# EAGLE design dio-pci (EAGLE 6.5.0)
DESIGNER: OPEN EPHYS; DESIGN_NAME: FMC ACQUISITION ADAPTER; REVISION: 0.1
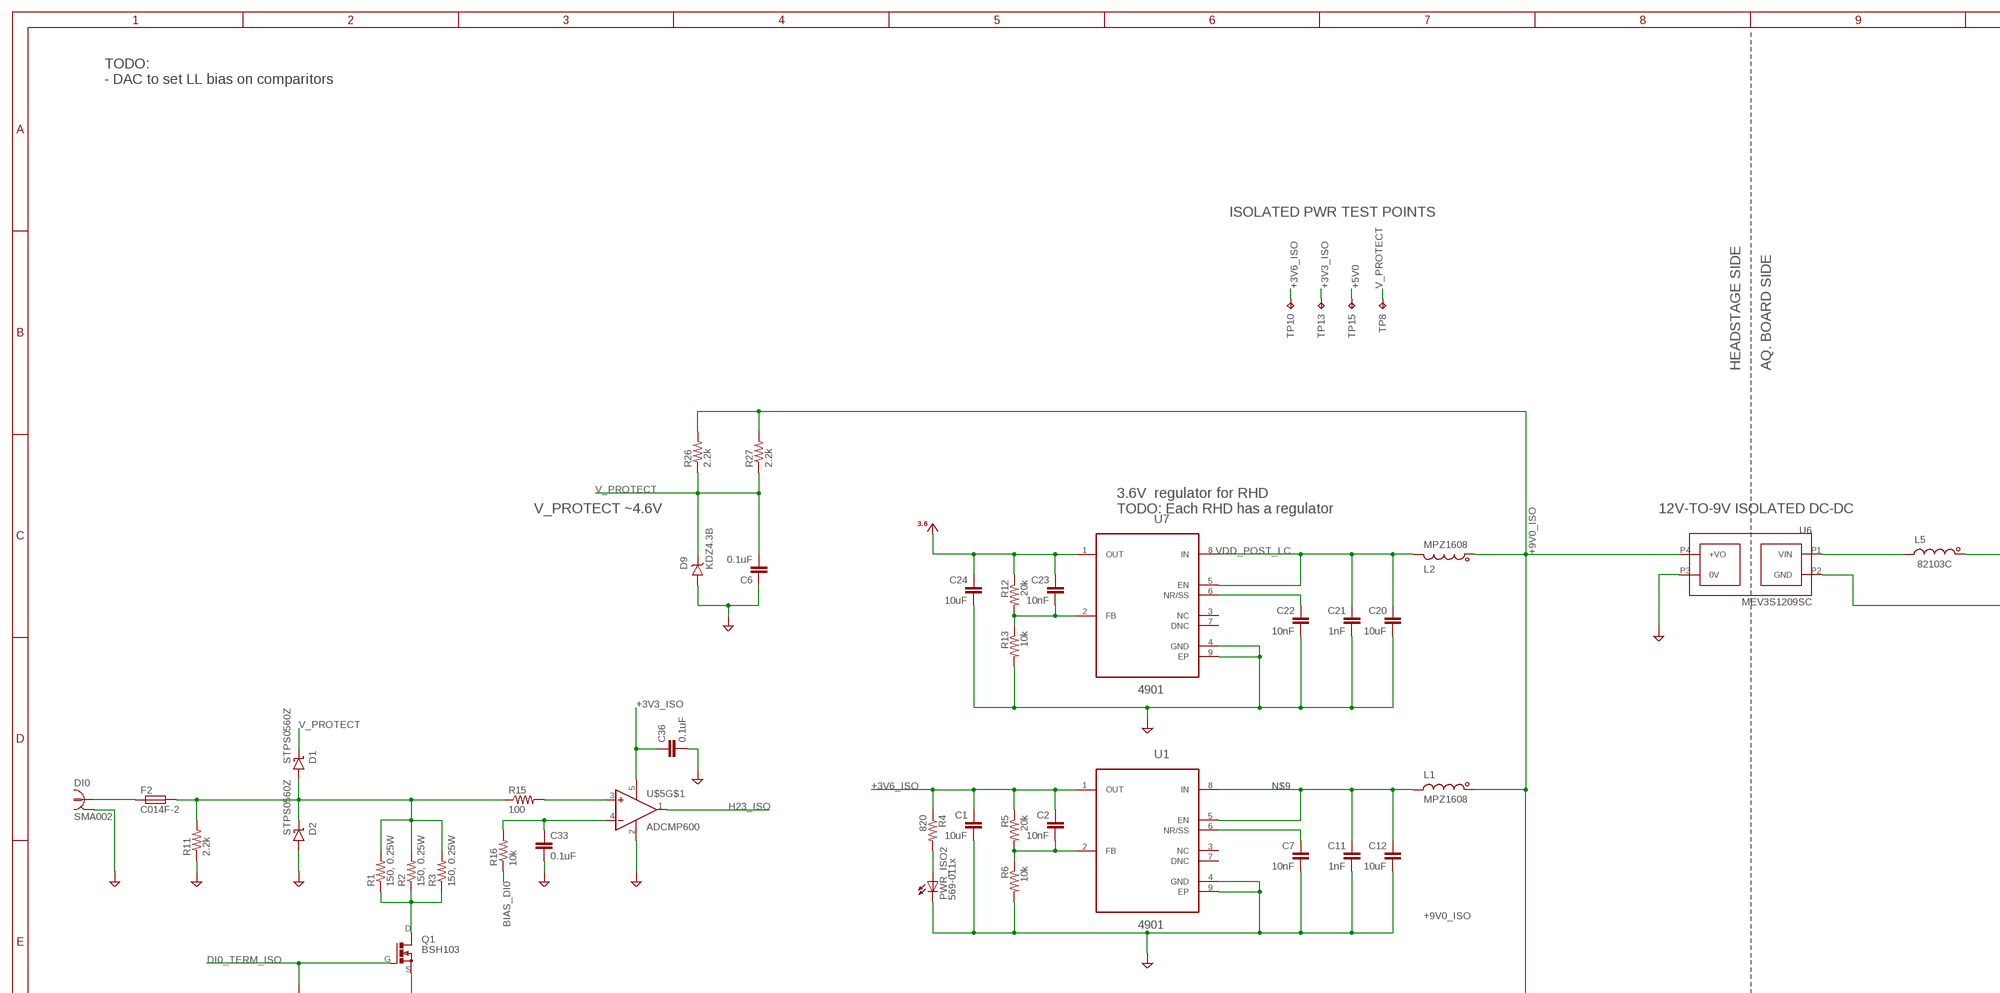
[diagram p0: schematic, sheet 1, part 1 of 3]
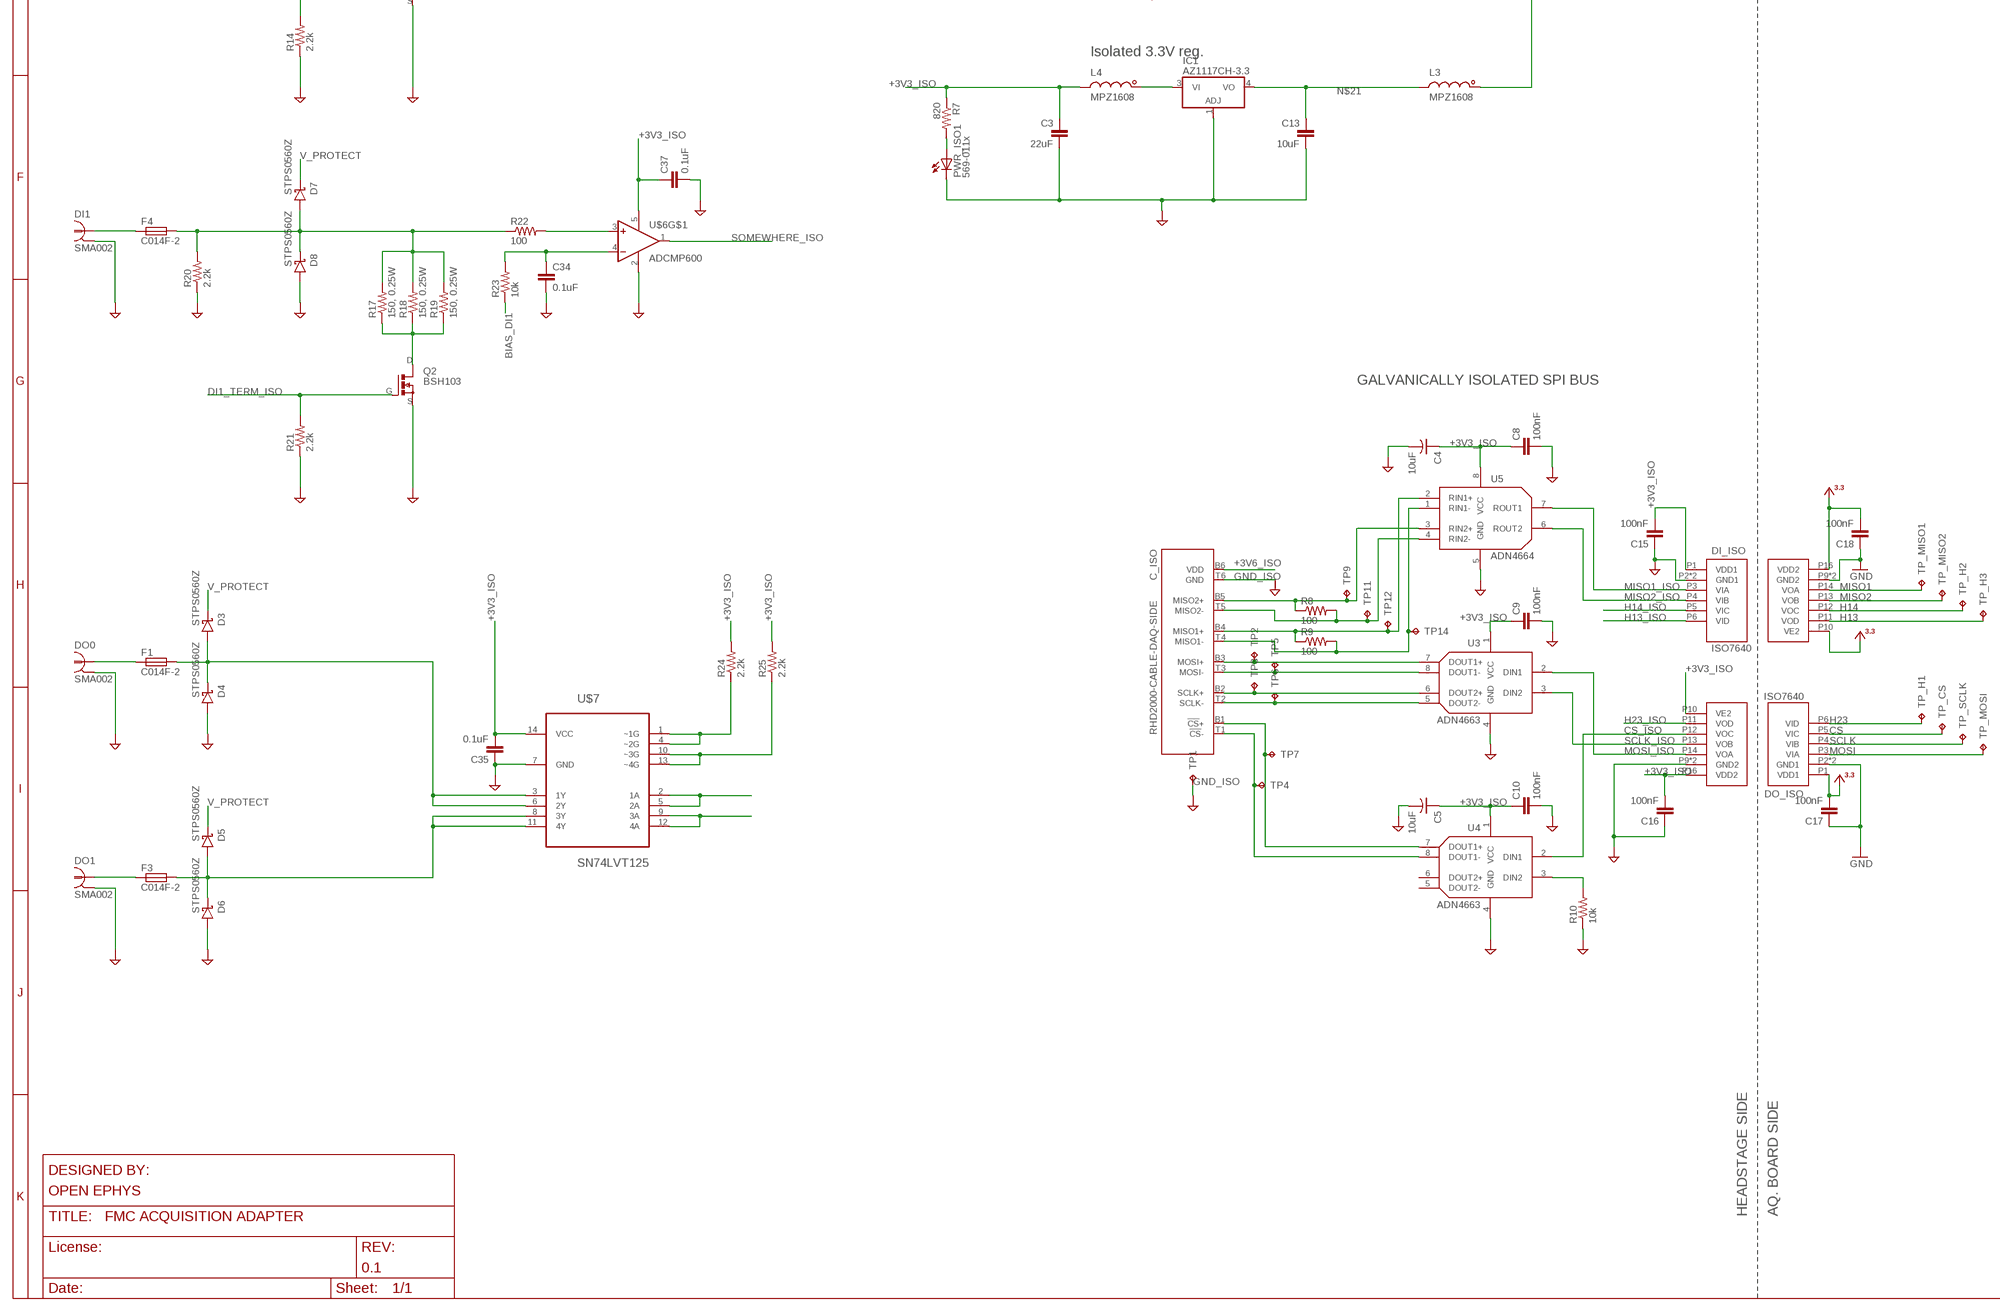
[diagram p1: schematic, sheet 1, part 2 of 3]
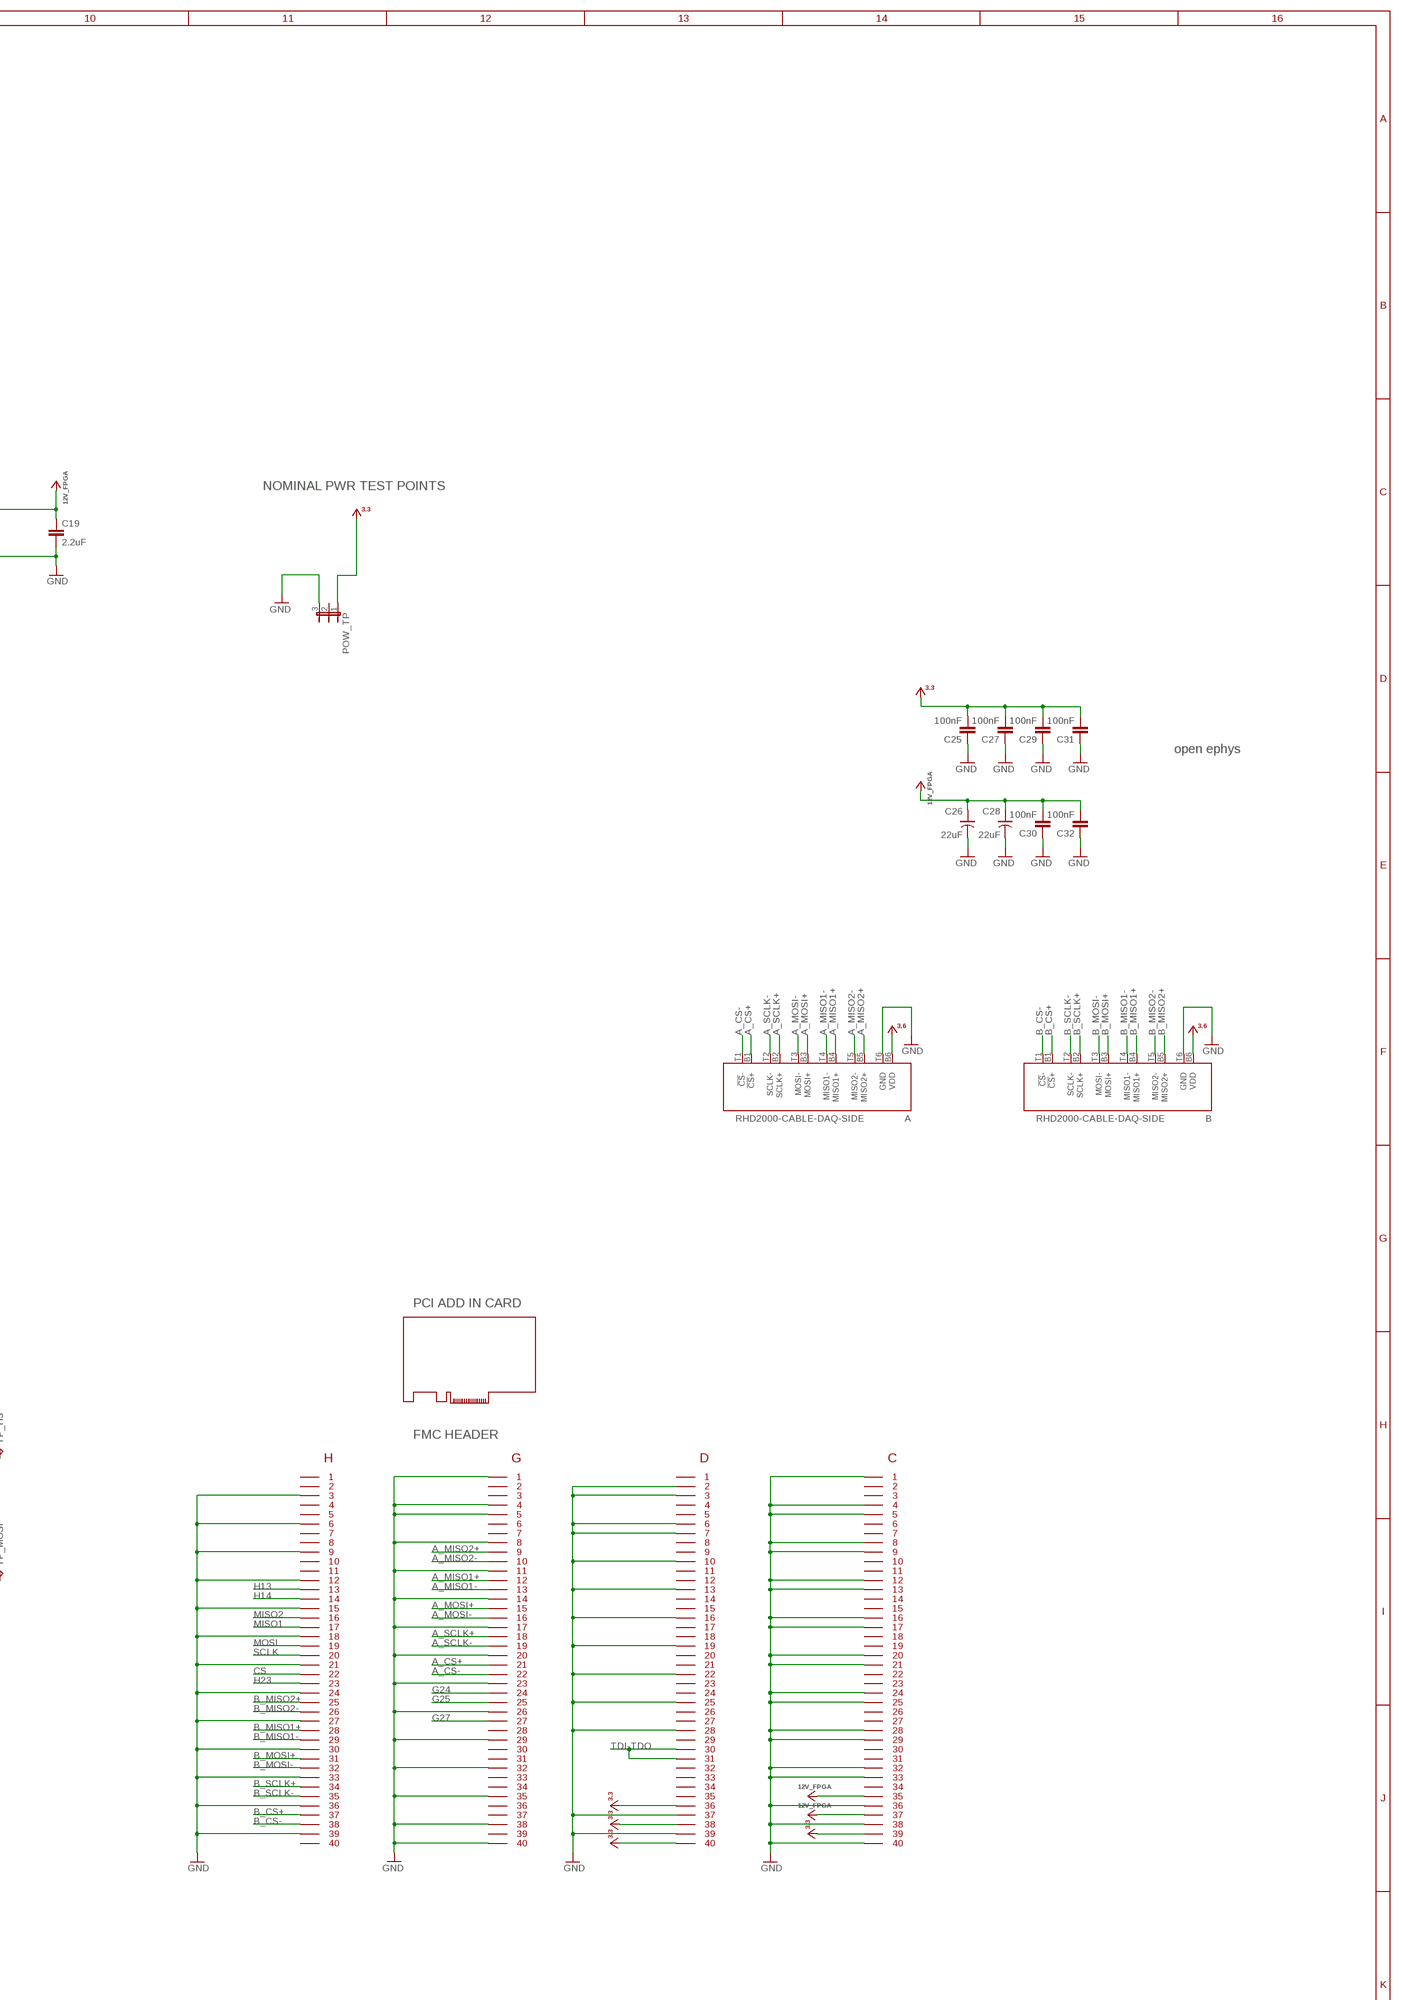
[diagram p2: schematic, sheet 1, part 3 of 3]

## Parts
A  RHD2000-CABLE-DAQ-SIDE  [OMNETICS_PZN-12-AA]
B  RHD2000-CABLE-DAQ-SIDE  [OMNETICS_PZN-12-AA]
C1  10uF  C_1206  [1206]
C2  10nF  C_0603  [0603]
C3  22uF  C_1206  [1206]
C4  10uF  C-POL_1206  [1206-POL]
C5  10uF  C-POL_1206  [1206-POL]
C6  0.1uF  C_0603  [0603]
C7  10nF  C_0603  [0603]
C8  100nF  C_0603  [0603]
C9  100nF  C_0603  [0603]
C10  100nF  C_0603  [0603]
C11  1nF  C_0603  [0603]
C12  10uF  C_1206  [1206]
C13  10uF  C_1206  [1206]
C15  100nF  C_0603  [0603]
C16  100nF  C_0603  [0603]
C17  100nF  C_0603  [0603]
C18  100nF  C_0603  [0603]
C19  2.2uF  C_1206  [1206]
C20  10uF  C_1206  [1206]
C21  1nF  C_0603  [0603]
C22  10nF  C_0603  [0603]
C23  10nF  C_0603  [0603]
C24  10uF  C_1206  [1206]
C25  100nF  C_0603  [0603]
C26  22uF  C-POL_1210  [1210-POL]
C27  100nF  C_0603  [0603]
C28  22uF  C-POL_1210  [1210-POL]
C29  100nF  C_0603  [0603]
C30  100nF  C_0603  [0603]
C31  100nF  C_0603  [0603]
C32  100nF  C_0603  [0603]
C33  0.1uF  C_0603  [0603]
C34  0.1uF  C_0603  [0603]
C35  0.1uF  C_0603  [0603]
C36  0.1uF  C_0603  [0603]
C37  0.1uF  C_0603  [0603]
C_ISO  RHD2000-CABLE-DAQ-SIDE  [OMNETICS_PZN-12-AA]
D1  STPS0560Z  S-DIODESOD-123  [SOD123]
D2  STPS0560Z  S-DIODESOD-123  [SOD123]
D3  STPS0560Z  S-DIODESOD-123  [SOD123]
D4  STPS0560Z  S-DIODESOD-123  [SOD123]
D5  STPS0560Z  S-DIODESOD-123  [SOD123]
D6  STPS0560Z  S-DIODESOD-123  [SOD123]
D7  STPS0560Z  S-DIODESOD-123  [SOD123]
D8  STPS0560Z  S-DIODESOD-123  [SOD123]
D9  KDZ4.3B  Z-DIODE_SOD123  [SOD123]
DI0  SMA002  COAX_CONREVSMA002-G  [SMA_JACK_CONREVSMA002-G]
DI1  SMA002  COAX_CONREVSMA002-G  [SMA_JACK_CONREVSMA002-G]
DI_ISO  ISO7640  ADUM3440  [SOIC_WIDE_16]
DO0  SMA002  COAX_CONREVSMA002-G  [SMA_JACK_CONREVSMA002-G]
DO1  SMA002  COAX_CONREVSMA002-G  [SMA_JACK_CONREVSMA002-G]
DO_ISO  ISO7640  ADUM3440  [SOIC_WIDE_16]
F1  C014F-2  FUSE_1812  [1812]
F2  C014F-2  FUSE_1812  [1812]
F3  C014F-2  FUSE_1812  [1812]
F4  C014F-2  FUSE_1812  [1812]
FMC  FMC_LPC_160_PIN  [FMC_LPC_MALE_WITH_SP601_BSILK]
IC1  AZ1117CH-3.3  317EMP  [SOT223]
L1  MPZ1608  L_0603  [0603]
L2  MPZ1608  L_0603  [0603]
L3  MPZ1608  L_0603  [0603]
L4  MPZ1608  L_0603  [0603]
L5  82103C  L_1210  [1210]
POW_TP  JP3E  [JP3]
PWR_ISO  569-011x  LED_2X_VERTICAL  [569-011X-X00_LED_ARRAY]
Q1  BSH103  N-MOSFET_SOT23-GSD  [SOT23-GSD]
Q2  BSH103  N-MOSFET_SOT23-GSD  [SOT23-GSD]
R1  150, 0.25W  R_1206  [1206]
R2  150, 0.25W  R_1206  [1206]
R3  150, 0.25W  R_1206  [1206]
R4  820  R_0603  [0603]
R5  20k  R_0603  [0603]
R6  10k  R_0603  [0603]
R7  820  R_0603  [0603]
R8  100  R_0603  [0603]
R9  100  R_0603  [0603]
R10  10k  R_0603  [0603]
R11  2.2k  R_0603  [0603]
R12  20k  R_0603  [0603]
R13  10k  R_0603  [0603]
R14  2.2k  R_0603  [0603]
R15  100  R_0603  [0603]
R16  10k  R_0603  [0603]
R17  150, 0.25W  R_1206  [1206]
R18  150, 0.25W  R_1206  [1206]
R19  150, 0.25W  R_1206  [1206]
R20  2.2k  R_0603  [0603]
R21  2.2k  R_0603  [0603]
R22  100  R_0603  [0603]
R23  10k  R_0603  [0603]
R24  2.2k  R_0603  [0603]
R25  2.2k  R_0603  [0603]
R26  2.2k  R_0603  [0603]
R27  2.2k  R_0603  [0603]
TP1  GND-ISO  TPPAD1-13  [P1-13]
TP2  MOSI+  TPTP06R  [TP06R]
TP3  SCLK+  TPTP06R  [TP06R]
TP4  CS-  TPTP06R  [TP06R]
TP5  MOSI-  TPTP06R  [TP06R]
TP6  SCLK-  TPTP06R  [TP06R]
TP7  CS+  TPTP06R  [TP06R]
TP8  +5V0  TPTP06R  [TP06R]
TP9  MISO2+  TPTP06R  [TP06R]
TP10  +3V6  TPTP06R  [TP06R]
TP11  MISO2-  TPTP06R  [TP06R]
TP12  MISO1+  TPTP06R  [TP06R]
TP13  +3V3  TPTP06R  [TP06R]
TP14  MISO1-  TPTP06R  [TP06R]
TP15  +5V0  TPTP06R  [TP06R]
TP_CS  CS  TPTP06R  [TP06R]
TP_H1  H23  TPTP06R  [TP06R]
TP_H2  H14  TPTP06R  [TP06R]
TP_H3  H13  TPTP06R  [TP06R]
TP_MISO1  MISO1  TPTP06R  [TP06R]
TP_MISO2  MISO2  TPTP06R  [TP06R]
TP_MOSI  MOSI  TPTP06R  [TP06R]
TP_SCLK  SCLK  TPTP06R  [TP06R]
U1  4901  TPS7A4901DGNR  [SOP65P490X110-9N]
U3  ADN4663  ADN4663_SOIC  [SOIC127P500X400-8N]
U4  ADN4663  ADN4663_SOIC  [SOIC127P500X400-8N]
U5  ADN4664  ADN4664_SOIC  [SOIC127P500X400-8N]
U6  MEV3S1209SC  DC-DC-CONVERTER_MEV3  [MEV3]
U7  4901  TPS7A4901DGNR  [SOP65P490X110-9N]
U$1  OPEN_EPHYS_LOGO  [OPEN_EPHYS_LOGO]
U$2  PCI-MECH_STD-H_HALF-W  [PCI-ADDIN_STD-H_HALF-L]
U$5  ADCMP600  COMPARITOR_ADCMP600  [SOT-23-5]
U$6  ADCMP600  COMPARITOR_ADCMP600  [SOT-23-5]
U$7  SN74LVT125  QUAD-LINE-DRIVER_SOIC  [SO14]

## Nets
12V_FPGA: C19.1 C26.+ C28.+ C30.2 C32.2 FMC.P$155 FMC.P$157 L5.1
$N1: D7.A D8.C F4.2 R17.2 R18.2 R19.2 R20.2 R22.1
$N3: D1.A D2.C F2.2 R1.2 R2.2 R3.2 R11.2 R15.1
$N101: D3.A D4.C F1.2 U$7.3(1Y) U$7.6(2Y)
$N102: D5.A D6.C F3.2 U$7.8(3Y) U$7.11(4Y)
+3V3: C17.2 C18.2 C25.2 C27.2 C29.2 C31.2 DI_ISO.P10(VE2) DI_ISO.P16(VDD2) DO_ISO.P1(VDD1) FMC.P$116 FMC.P$118 FMC.P$120 FMC.P$159 POW_TP.1
+3V3_ISO: C3.1 C4.+ C5.+ C8.1 C9.1 C10.1 C15.2 C16.2 C35.2 C36.1 C37.1 DI_ISO.P1(VDD1) DO_ISO.P10(VE2) DO_ISO.P16(VDD2) L4.2 R7.1 R24.2 R25.2 TP13.TP U3.1(VCC) U4.1(VCC) U5.8(VCC) U$5.5(V+) U$6.5(V+) U$7.14(VCC)
+3V6: A.B6(VDD) B.B6(VDD) C23.1 C24.1 R12.1 U7.1(OUT)
+3V6_ISO: C1.1 C2.1 C_ISO.B6(VDD) R4.1 R5.1 TP10.TP U1.1(OUT)
+5V0: TP15.TP
+9V0_ISO: L1.1 L2.1 L3.1 R26.2 R27.2 U6.P4(+VO)
A_CS+: A.B1(!CS!+) FMC.P$61
A_CS-: A.T1(!CS!-) FMC.P$62
A_MISO1+: A.B4(MISO1+) FMC.P$52
A_MISO1-: A.T4(MISO1-) FMC.P$53
A_MISO2+: A.B5(MISO2+) FMC.P$49
A_MISO2-: A.T5(MISO2-) FMC.P$50
A_MOSI+: A.B3(MOSI+) FMC.P$55
A_MOSI-: A.T3(MOSI-) FMC.P$56
A_SCLK+: A.B2(SCLK+) FMC.P$58
A_SCLK-: A.T2(SCLK-) FMC.P$59
AGND1: C23.2 R12.2 R13.1 U7.2(FB)
AGND2: C2.2 R5.2 R6.1 U1.2(FB)
B_CS+: B.B1(!CS!+) FMC.P$37
B_CS-: B.T1(!CS!-) FMC.P$38
B_MISO1+: B.B4(MISO1+) FMC.P$28
B_MISO1-: B.T4(MISO1-) FMC.P$29
B_MISO2+: B.B5(MISO2+) FMC.P$25
B_MISO2-: B.T5(MISO2-) FMC.P$26
B_MOSI+: B.B3(MOSI+) FMC.P$31
B_MOSI-: B.T3(MOSI-) FMC.P$32
B_SCLK+: B.B2(SCLK+) FMC.P$34
B_SCLK-: B.T2(SCLK-) FMC.P$35
BIAS_DI0: R16.1
BIAS_DI1: R23.1
CS: DO_ISO.P5(VIC) FMC.P$22 TP_CS.TP
CS+_ISOLATED: C_ISO.B1(!CS!+) TP7.TP U4.7(DOUT1+)
CS-_ISOLATED: C_ISO.T1(!CS!-) TP4.TP U4.8(DOUT1-)
CS_ISO: DO_ISO.P12(VOC) U4.2(DIN1)
DI0_TERM_ISO: Q1.G R14.2
DI1_TERM_ISO: Q2.G R21.2
G24: FMC.P$64
G25: FMC.P$65
G27: FMC.P$67
GND: A.T6(GND) B.T6(GND) C17.1 C18.1 C19.2 C25.1 C26.- C27.1 C28.- C29.1 C30.1 C31.1 C32.1 DI_ISO.P9(GND2) DI_ISO.P15(GND2) DO_ISO.P2(GND1) DO_ISO.P8(GND1) FMC.P$3 FMC.P$6 FMC.P$9 FMC.P$12 FMC.P$15 FMC.P$18 FMC.P$21 FMC.P$24 FMC.P$27 FMC.P$30 FMC.P$33 FMC.P$36 FMC.P$39 FMC.P$41 FMC.P$44 FMC.P$45 FMC.P$48 FMC.P$51 FMC.P$54 FMC.P$57 FMC.P$60 FMC.P$63 FMC.P$66 FMC.P$69 FMC.P$72 FMC.P$75 FMC.P$78 FMC.P$80 FMC.P$82 FMC.P$83 FMC.P$86 FMC.P$87 FMC.P$90 FMC.P$93 FMC.P$96 FMC.P$99 FMC.P$102 FMC.P$105 FMC.P$108 FMC.P$117 FMC.P$119 FMC.P$121 FMC.P$124 FMC.P$125 FMC.P$128 FMC.P$129 FMC.P$132 FMC.P$133 FMC.P$136 FMC.P$137 FMC.P$140 FMC.P$141 FMC.P$144 FMC.P$145 FMC.P$148 FMC.P$149 FMC.P$152 FMC.P$153 FMC.P$156 FMC.P$158 FMC.P$160 POW_TP.3 U6.P2(GND)
GND_ISO: C1.2 C3.2 C4.- C5.- C6.1 C7.2 C8.2 C9.2 C10.2 C11.2 C12.2 C13.2 C15.1 C16.1 C20.2 C21.2 C22.2 C24.2 C33.2 C34.2 C35.1 C36.2 C37.2 C_ISO.T6(GND) D2.A D4.A D6.A D8.A D9.A DI0.GND$1 DI0.GND$2 DI0.GND$3 DI0.GND$4 DI1.GND$1 DI1.GND$2 DI1.GND$3 DI1.GND$4 DI_ISO.P2(GND1) DI_ISO.P8(GND1) DO0.GND$1 DO0.GND$2 DO0.GND$3 DO0.GND$4 DO1.GND$1 DO1.GND$2 DO1.GND$3 DO1.GND$4 DO_ISO.P9(GND2) DO_ISO.P15(GND2) IC1.1(ADJ) PWR_ISO.C1(1:C) PWR_ISO.C2(2:C) Q1.S Q2.S R6.2 R10.1 R11.1 R13.2 R14.1 R20.1 R21.1 TP1.TP U1.4(GND) U1.9(EP) U3.4(GND) U4.4(GND) U5.5(GND) U6.P3(0V) U7.4(GND) U7.9(EP) U$5.2(V-) U$6.2(V-) U$7.7(GND)
H13: DI_ISO.P11(VOD) FMC.P$13 TP_H3.TP
H13_ISO: DI_ISO.P6(VID) U$7.9(3A) U$7.12(4A)
H14: DI_ISO.P12(VOC) FMC.P$14 TP_H2.TP
H14_ISO: DI_ISO.P5(VIC) U$7.2(1A) U$7.5(2A)
H23: DO_ISO.P6(VID) FMC.P$23 TP_H1.TP
H23_ISO: DO_ISO.P11(VOD) U$5.1(OUT)
MISO1: DI_ISO.P14(VOA) FMC.P$17 TP_MISO1.TP
MISO1+_ISOLATED: C_ISO.B4(MISO1+) R9.1 TP12.TP U5.2(RIN1+)
MISO1-_ISOLATED: C_ISO.T4(MISO1-) R9.2 TP14.TP U5.1(RIN1-)
MISO1_ISO: DI_ISO.P3(VIA) U5.7(ROUT1)
MISO2: DI_ISO.P13(VOB) FMC.P$16 TP_MISO2.TP
MISO2+_ISOLATED: C_ISO.B5(MISO2+) R8.1 TP9.TP U5.3(RIN2+)
MISO2-_ISOLATED: C_ISO.T5(MISO2-) R8.2 TP11.TP U5.4(RIN2-)
MISO2_ISO: DI_ISO.P4(VIB) U5.6(ROUT2)
MOSI: DO_ISO.P3(VIA) FMC.P$19 TP_MOSI.TP
MOSI_ISO: DO_ISO.P14(VOA) U3.2(DIN1)
N$1: C22.1 U7.6(NR/SS)
N$2: Q1.D R1.1 R2.1 R3.1
N$3: R15.2 U$5.3(+IN)
N$4: C7.1 U1.6(NR/SS)
N$5: R10.2 U4.3(DIN2)
N$6: DI1.CLK F4.1
N$7: Q2.D R17.1 R18.1 R19.1
N$8: PWR_ISO.A2(2:A) R4.2
N$9: C11.1 C12.1 L1.2 U1.5(EN) U1.8(IN)
N$10: PWR_ISO.A1(1:A) R7.2
N$11: DI0.CLK F2.1
N$12: C_ISO.B3(MOSI+) TP2.TP U3.7(DOUT1+)
N$13: C_ISO.T3(MOSI-) TP5.TP U3.8(DOUT1-)
N$14: DO0.CLK F1.1
N$15: C_ISO.B2(SCLK+) TP3.TP U3.6(DOUT2+)
N$16: C_ISO.T2(SCLK-) TP6.TP U3.5(DOUT2-)
N$17: DO1.CLK F3.1
N$18: C33.1 R16.2 U$5.4(-IN)
N$19: R22.2 U$6.3(+IN)
N$20: C34.1 R23.2 U$6.4(-IN)
N$21: C13.1 IC1.4(VO) L3.2
N$22: IC1.3(VI) L4.1
N$23: L5.2 U6.P1(VIN)
N$24: R24.1 U$7.1(~1G) U$7.4(~2G)
N$25: R25.1 U$7.10(~3G) U$7.13(~4G)
SCLK: DO_ISO.P4(VIB) FMC.P$20 TP_SCLK.TP
SCLK_ISO: DO_ISO.P13(VOB) U3.3(DIN2)
SOMEWHERE_ISO: U$6.1(OUT)
TDI-TDO: FMC.P$110 FMC.P$111
V_PROTECT: C6.2 D1.C D3.C D5.C D7.C D9.C R26.1 R27.1 TP8.TP
VDD_POST_LC: C20.1 C21.1 L2.2 U7.5(EN) U7.8(IN)
Unconnected: FMC.P$1 FMC.P$2 FMC.P$4 FMC.P$5 FMC.P$7 FMC.P$8 FMC.P$10 FMC.P$11 FMC.P$40 FMC.P$42 FMC.P$43 FMC.P$46 FMC.P$47 FMC.P$68 FMC.P$70 FMC.P$71 FMC.P$73 FMC.P$74 FMC.P$76 FMC.P$77 FMC.P$79 FMC.P$81 FMC.P$84 FMC.P$85 FMC.P$88 FMC.P$89 FMC.P$91 FMC.P$92 FMC.P$94 FMC.P$95 FMC.P$97 FMC.P$98 FMC.P$100 FMC.P$101 FMC.P$103 FMC.P$104 FMC.P$106 FMC.P$107 FMC.P$109 FMC.P$112 FMC.P$113 FMC.P$114 FMC.P$115 FMC.P$122 FMC.P$123 FMC.P$126 FMC.P$127 FMC.P$130 FMC.P$131 FMC.P$134 FMC.P$135 FMC.P$138 FMC.P$139 FMC.P$142 FMC.P$143 FMC.P$146 FMC.P$147 FMC.P$150 FMC.P$151 FMC.P$154 POW_TP.2 U1.3(NC) U1.7(DNC) U4.5(DOUT2-) U4.6(DOUT2+) U7.3(NC) U7.7(DNC)

## Notes on the sheet
- TODO:
  - DAC to set LL bias on comparitors
- ISOLATED PWR TEST POINTS
- HEADSTAGE SIDE | AQ. BOARD SIDE
- V_PROTECT ~4.6V
- 3.6V  regulator for RHD
  TODO: Each RHD has a regulator
- 12V-TO-9V ISOLATED DC-DC
- NOMINAL PWR TEST POINTS
- Isolated 3.3V reg.
- GALVANICALLY ISOLATED SPI BUS
- PCI ADD IN CARD
- FMC HEADER
- HEADSTAGE SIDE | AQ. BOARD SIDE

## Power pins joined to a net without a drawn wire
GND: FMC.GNDA(GND$1:GND) FMC.GNDB(GND$2:GND)

## Library data of the parts
A B C_ISO = RHD2000_eval_board:RHD2000-CABLE-DAQ-SIDE: Omnetics PZN-12-AA RHD2000 socket - DAQ side
C1 C12 C20 C24 = puggleboard:C: Capacitor
C2 C6 C7 C11 C13 C19 C21-C23 C33 C34 C36 C37 = jonnew:C: Capacitor
C3 C8-C10 C15-C18 C25 C27 C29-C32 C35 = RHD2000_eval_board:C: Capacitor
C4 C5 C26 C28 = jonnew:C-POL: Polarized Capacitor
D1-D8 = jonnew:S-DIODE: Schottky Diode
D9 = jonnew:Z-DIODE: Zener Diode
DI0 DI1 DO0 DO1 = jonnew:COAX: COAX CONNECTOR - Edge mount BNC - Vertical BNC - Vertical SMA - etc
DI_ISO DO_ISO = jonnew:ADUM3440
F1-F4 = jonnew:FUSE
FMC = jonnew:FMC_LPC_160_PIN
IC1 = jonnew:*317: Positive VOLTAGE REGULATOR
L1-L5 = jonnew:L: Inductor
POW_TP = jonnew:JP3E
PWR_ISO = jonnew:LED_2X
Q1 Q2 = jonnew:N-MOSFET: N-CHANNEL MOS FET SYMBOL
R1-R3 R17-R19 = jonnew:R: Resistor
R4 R7-R9 = RHD2000_eval_board:R: Resistor
R5 R6 R10-R16 R20-R27 = jonnew:R: Resistor; DK: PxxxxHTR-ND; MN: Panasonic; MPN: ERJ-3EKFxxxxV
TP1-TP15 TP_CS TP_H1-TP_H3 TP_MISO1 TP_MISO2 TP_MOSI TP_SCLK = jonnew:TP: Test pad
U1 U7 = jonnew:TPS7A4901DGNR: ?36V, ?200mA, Ultralow-Noise, Negative LINEAR REGULATOR; MPN: TPS7A4901DGNR; OC_FARNELL: -; OC_NEWARK: 01T0879; PACKAGE: MSOP-8; SUPPLIER: Texas Instruments
U3 U4 = jonnew:ADN4663: Dual 3V3 CMOS to LVDS differential line driver
U5 = jonnew:ADN4664: Dual LVLDS to 3V3 CMOS differential line receiver
U6 = jonnew:DC-DC-CONVERTER: DC-DC converter modules
U$1 = open-ephys:OPEN_EPHYS_LOGO: Open Ephys logo
U$2 = jonnew:PCI-MECH
U$5 U$6 = jonnew:COMPARITOR
U$7 = jonnew:QUAD-LINE-DRIVER

## Board
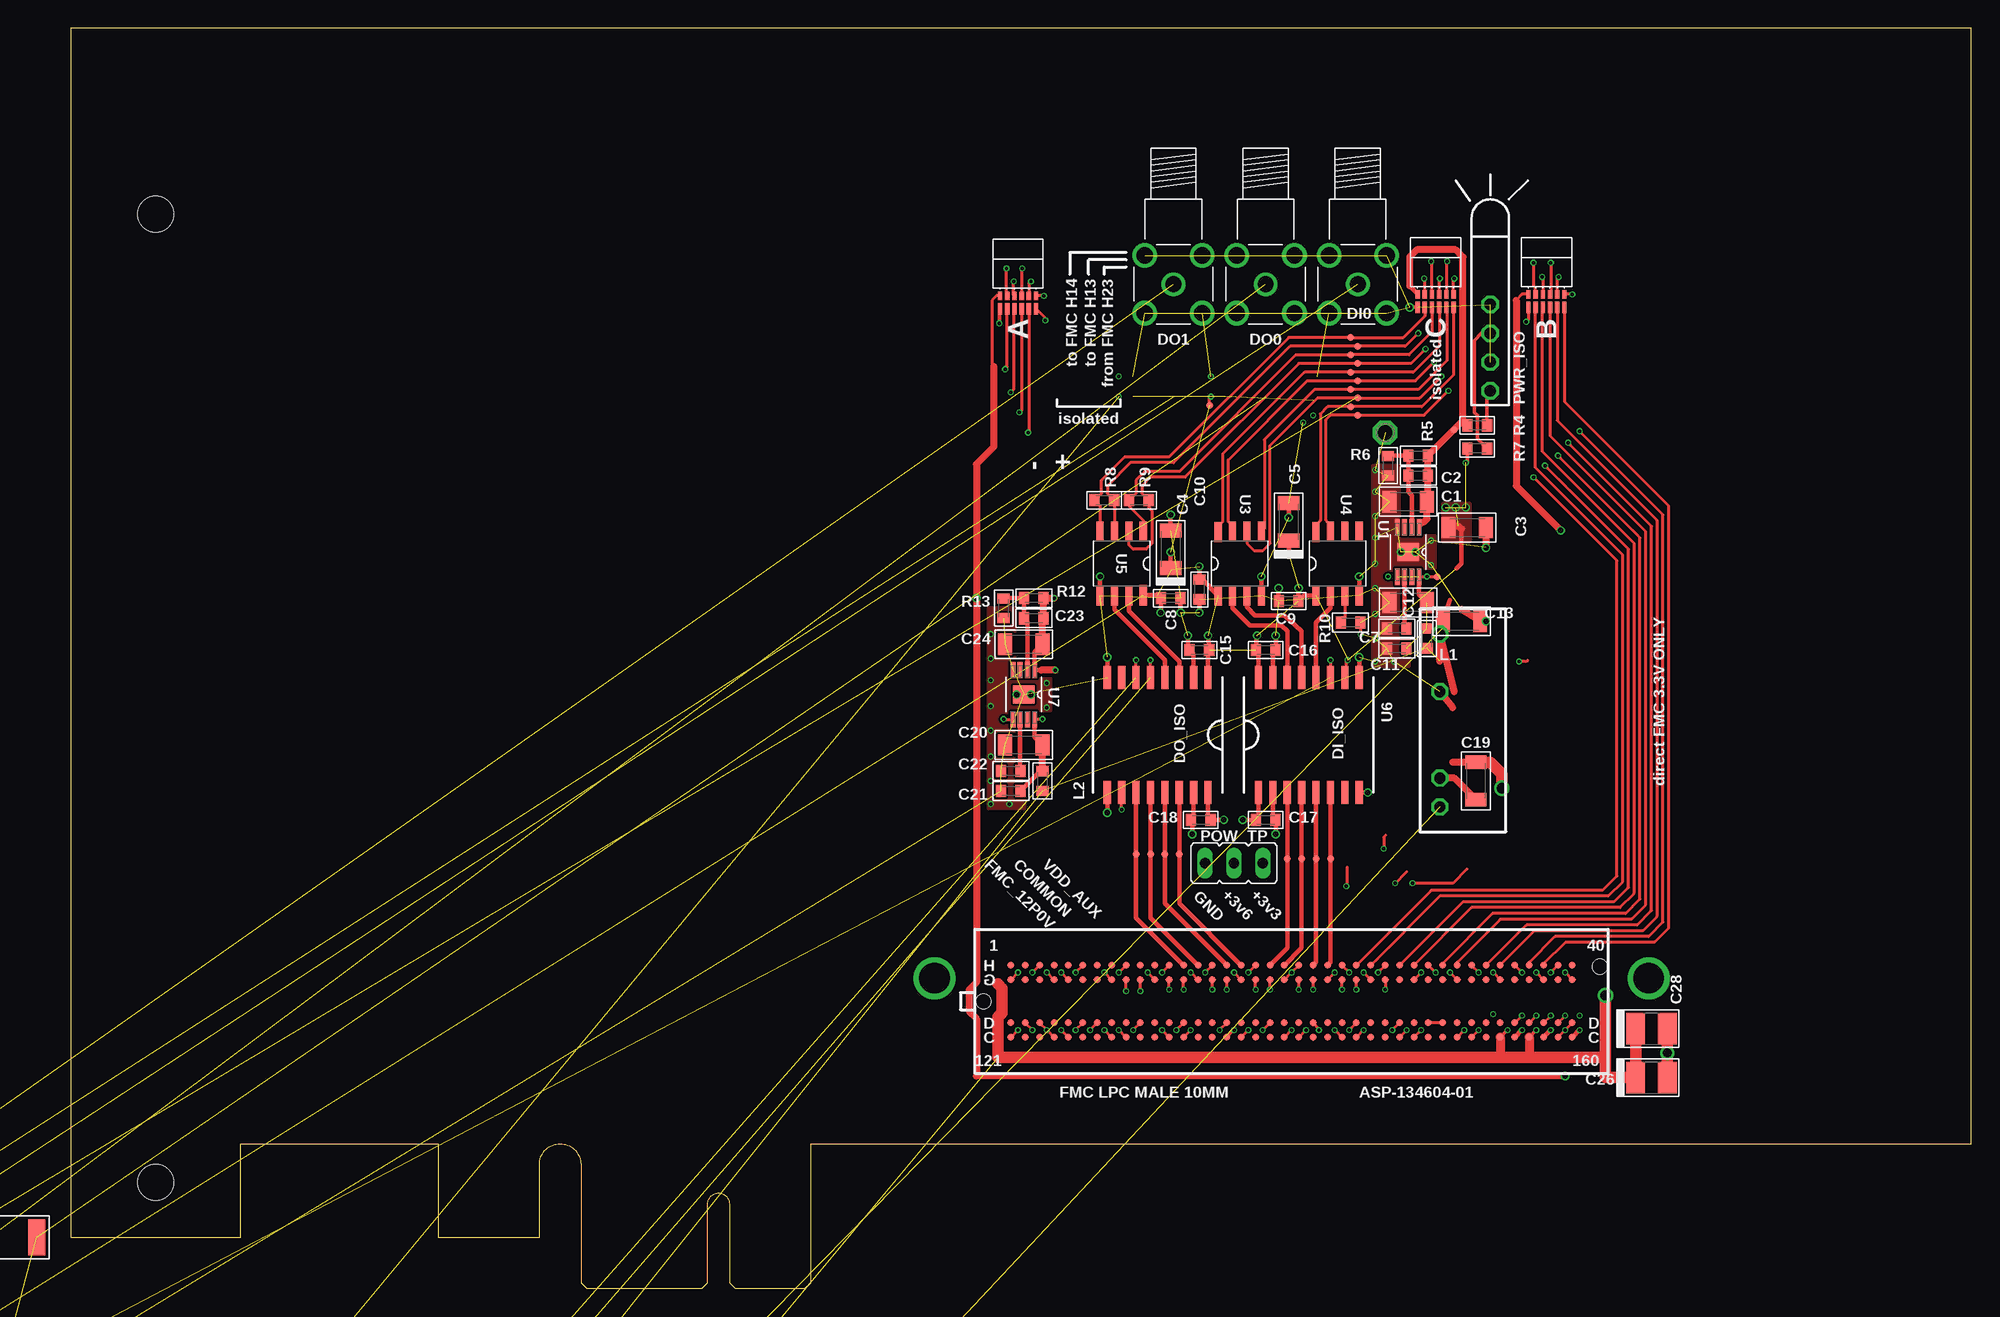
[diagram p3: board, top side]
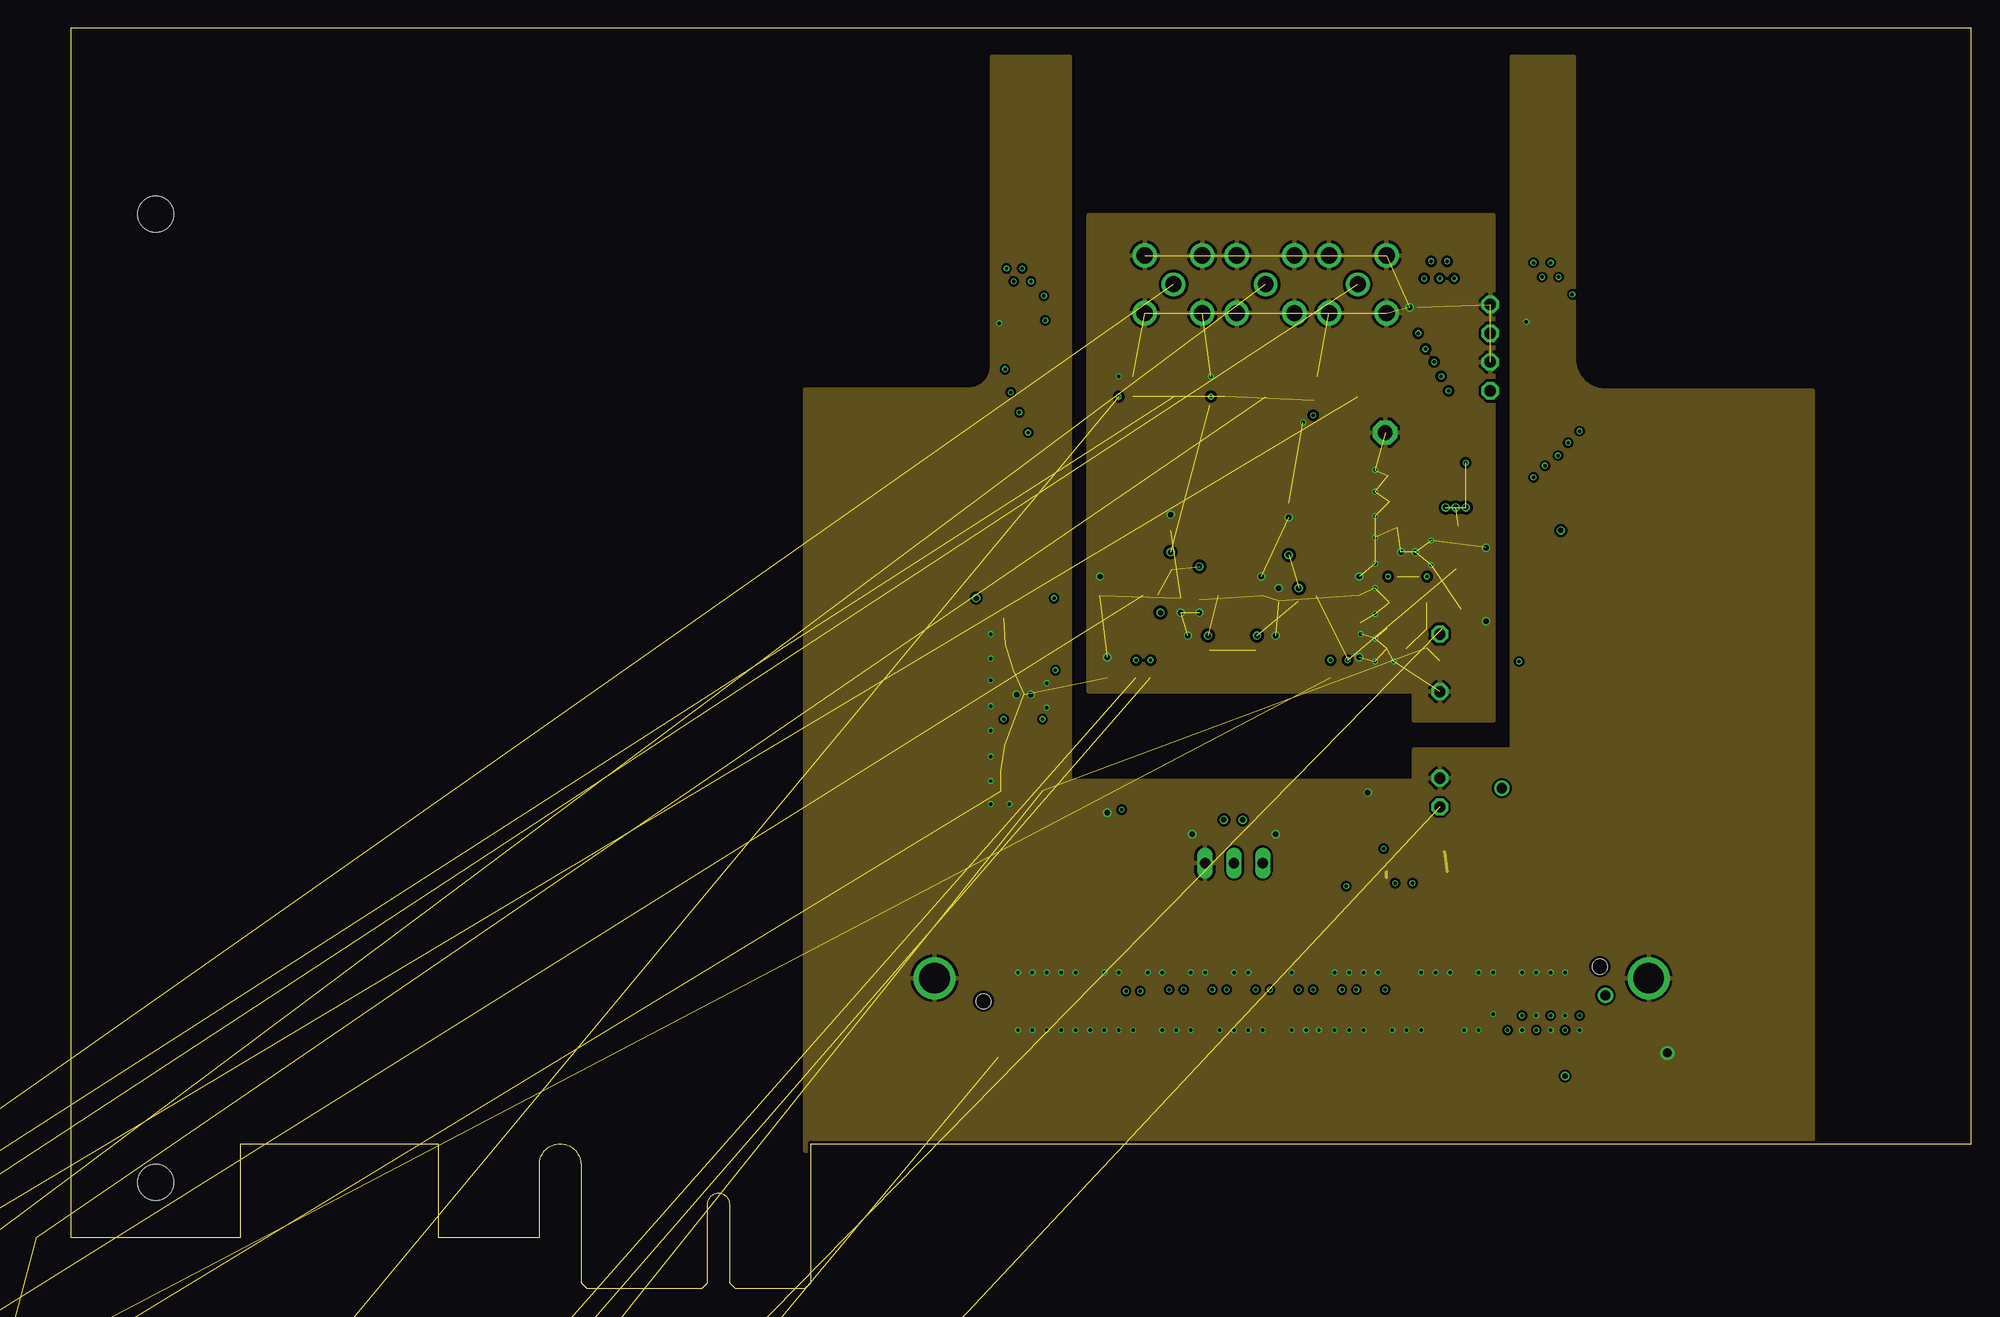
[diagram p4: board, inner layer $GND]
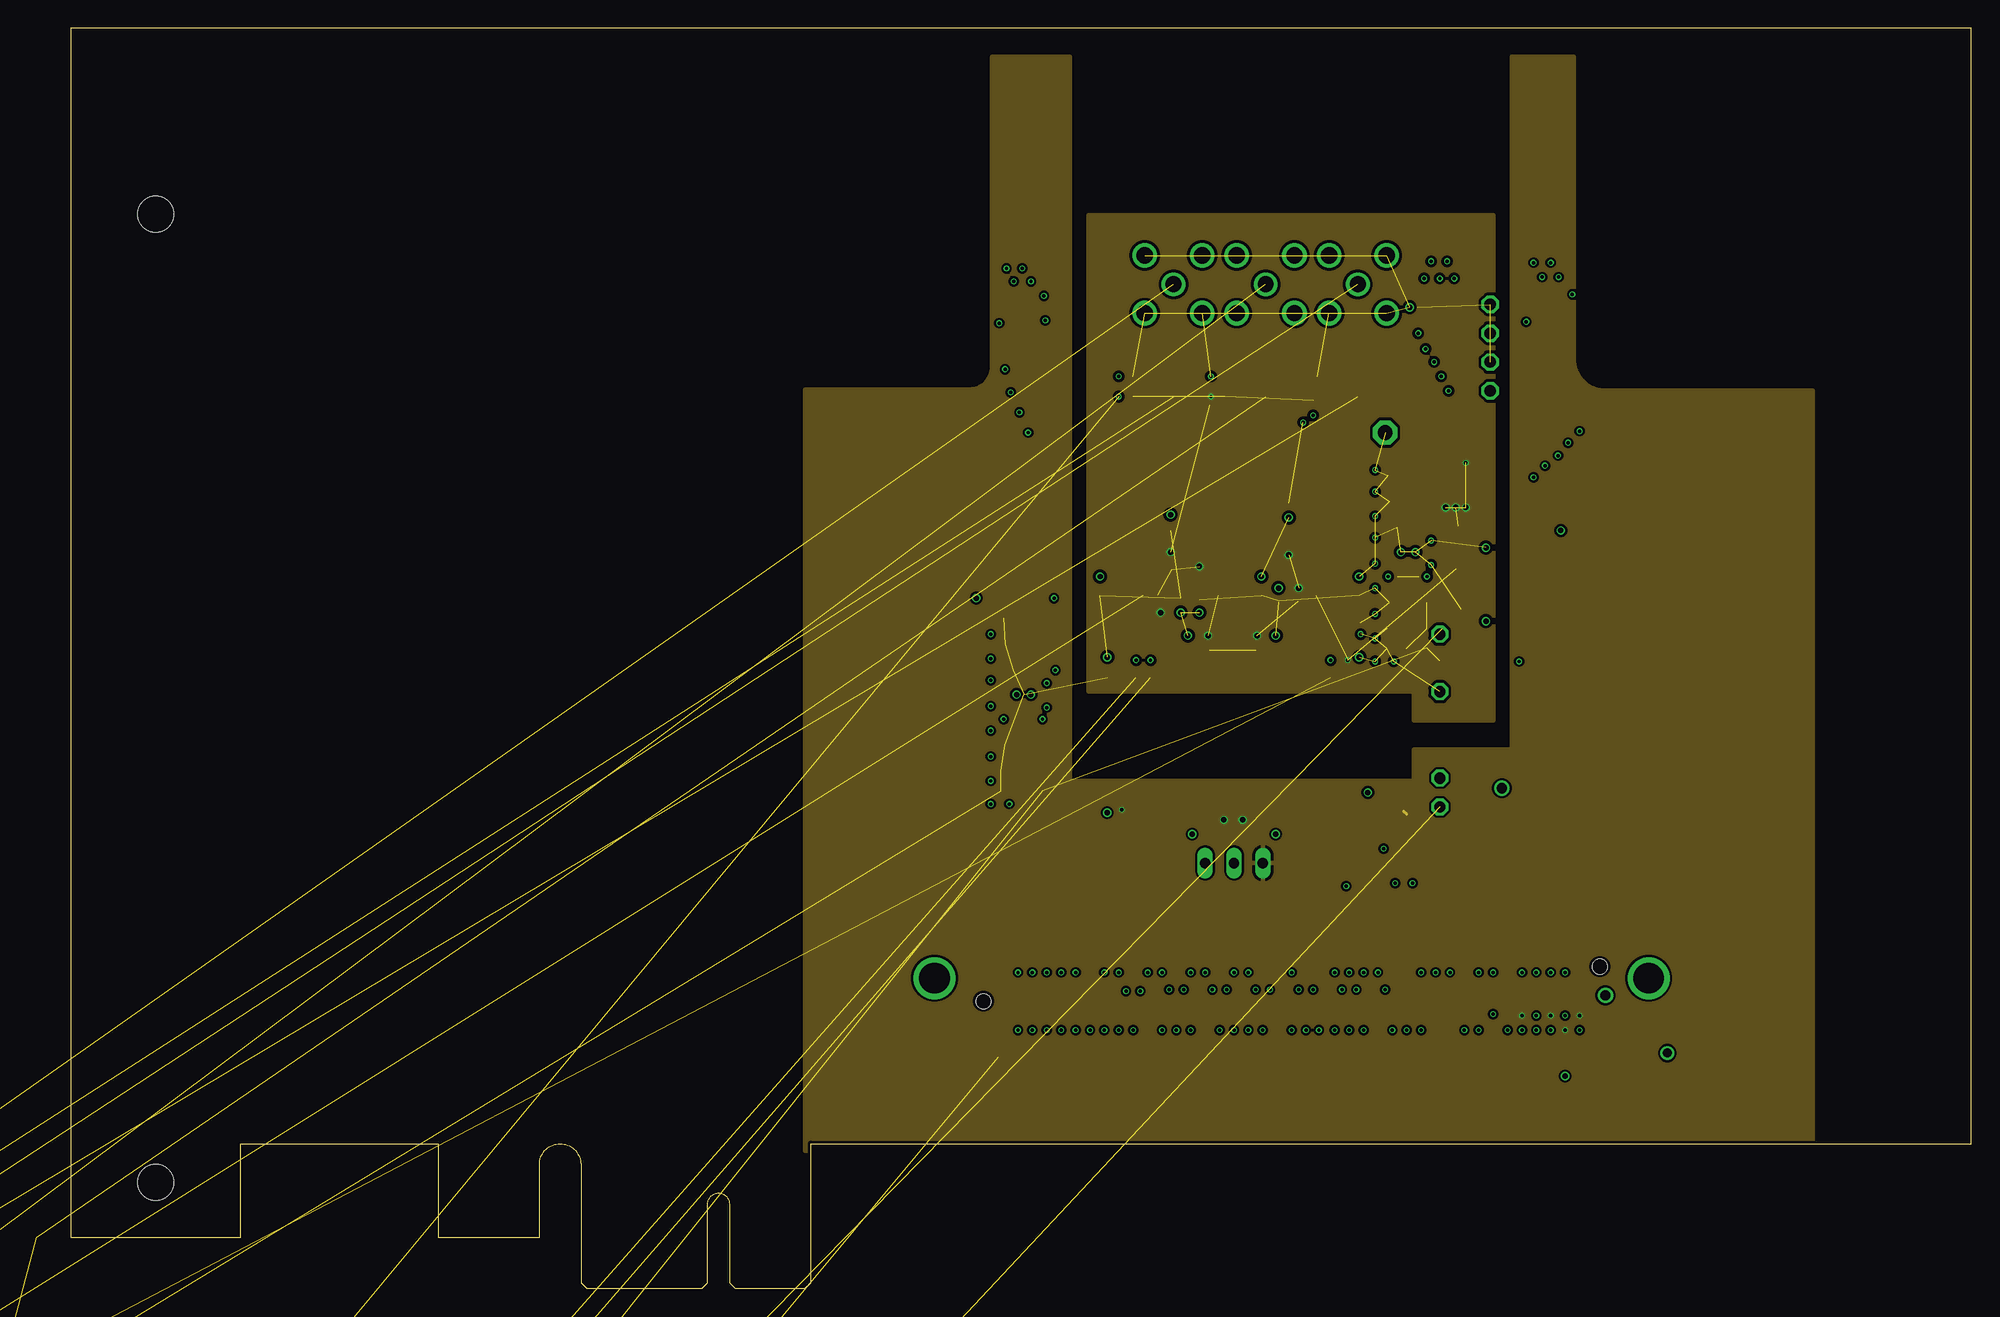
[diagram p5: board, inner layer $VCC]
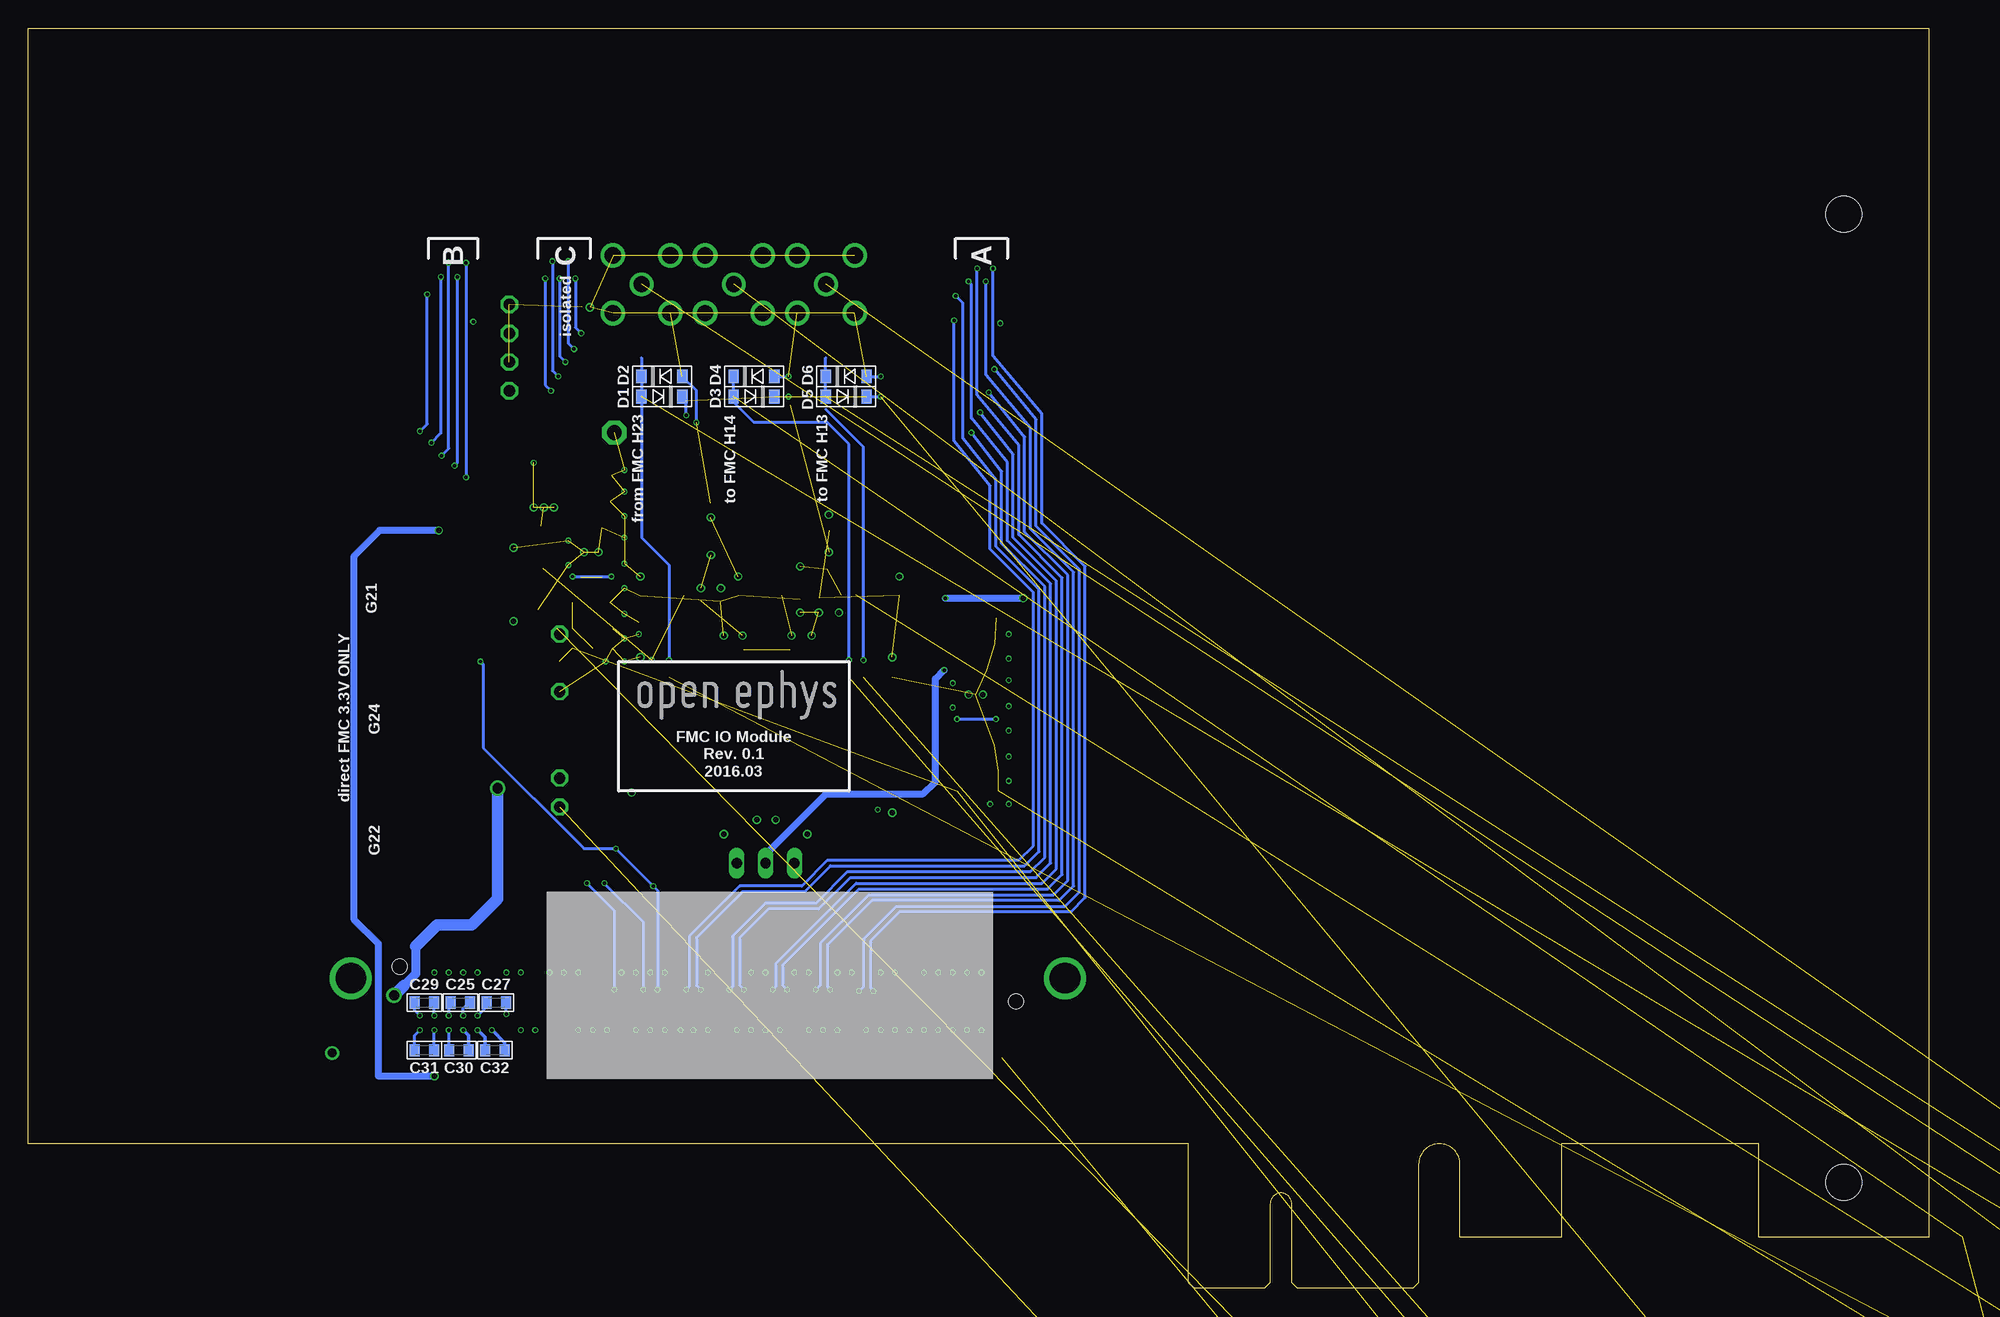
[diagram p6: board, bottom side, seen from below]

Size 167.64 x 111.15 mm. Coordinates in mm from the lower left corner, seen from the top.
Copper layers (1*2*15*16): Top 0.035mm / dielectric 0.2mm / $GND 0.0175mm / dielectric 0.3mm / $VCC 0.0175mm / dielectric 0.2mm / Bottom 0.035mm
Design rules "seeed-studio-4-layer": minimum track width 8mil, minimum drill 12mil, track to track 8mil, track to pad 8mil, pad to pad 8mil, via to via 8mil, smd to smd 0mil, copper to edge 10mil, drill to drill 8mil, minimum pad ring 6mil, minimum via ring 4mil, stop-mask expansion 4mil, vias tented up to drill 100mil, thermal gap 10mil

### Footprints (pad centres in the part's own frame; a part is rotated, then mirrored left to right if it is on the bottom)
OMNETICS_PZN-12-AA = smd 0.381 x 0.762: B1 1.587,-1.016; B2 0.953,-1.016; B3 0.318,-1.016; B4 -0.318,-1.016; B5 -0.953,-1.016; B6 -1.587,-1.016 | smd 0.381 x 1.016: T1 1.587,-2.159; T2 0.953,-2.159; T3 0.318,-2.159; T4 -0.318,-2.159; T5 -0.953,-2.159; T6 -1.587,-2.159
1206 = smd 1.219 x 1.88: 1 -1.651,0; 2 1.651,0
0603 = smd 0.889 x 1.067: 1 -0.864,0; 2 0.864,0
1206-POL = smd 1.219 x 1.88: + -1.651,0; - 1.651,0
1210-POL = smd 1.651 x 2.794: + -1.397,0; - 1.397,0
SOD123 = smd 0.914 x 1.219: A -1.8,0; C 1.8,0
SMA_JACK_CONREVSMA002-G = drill 1.397: CLK 0,0 | drill 1.448: GND$1 -2.54,2.54; GND$2 2.54,2.54; GND$3 -2.54,-2.54; GND$4 2.54,-2.54
SOIC_WIDE_16 = smd 0.635 x 2.032: P1 -4.445,-5.08; P2 -3.175,-5.08; P3 -1.905,-5.08; P4 -0.635,-5.08; P5 0.635,-5.08; P6 1.905,-5.08; P7 3.175,-5.08; P8 4.445,-5.08; P9 4.445,5.08; P10 3.175,5.08; P11 1.905,5.08; P12 0.635,5.08; P13 -0.635,5.08; P14 -1.905,5.08; P15 -3.175,5.08; P16 -4.445,5.08
1812 = smd 1.5 x 3.2: 1 -2.1,0; 2 2.1,0
FMC_LPC_MALE_WITH_SP601_BSILK = drill 2.692: GNDA -31.496,2.032; GNDB 31.496,2.032 | smd 0.635 x 0.635 bottom: P$1 24.765,3.175; P$2 23.495,3.175; P$3 22.225,3.175; P$4 20.955,3.175; P$5 19.685,3.175; P$6 18.415,3.175; P$7 17.145,3.175; P$8 15.875,3.175; P$9 14.605,3.175; P$10 13.335,3.175; P$11 12.065,3.175; P$12 10.795,3.175; P$13 9.525,3.175; P$14 8.255,3.175; P$15 6.985,3.175; P$16 5.715,3.175; P$17 4.445,3.175; P$18 3.175,3.175; P$19 1.905,3.175; P$20 0.635,3.175; P$21 -0.635,3.175; P$22 -1.905,3.175; P$23 -3.175,3.175; P$24 -4.445,3.175; P$25 -5.715,3.175; P$26 -6.985,3.175; P$27 -8.255,3.175; P$28 -9.525,3.175; P$29 -10.795,3.175; P$30 -12.065,3.175; P$31 -13.335,3.175; P$32 -14.605,3.175; P$33 -15.875,3.175; P$34 -17.145,3.175; P$35 -18.415,3.175; P$36 -19.685,3.175; P$37 -20.955,3.175; P$38 -22.225,3.175; P$39 -23.495,3.175; P$40 -24.765,3.175; P$41 24.765,1.905; P$42 23.495,1.905; P$43 22.225,1.905; P$44 20.955,1.905; P$45 19.685,1.905; P$46 18.415,1.905; P$47 17.145,1.905; P$48 15.875,1.905; P$49 14.605,1.905; P$50 13.335,1.905; P$51 12.065,1.905; P$52 10.795,1.905; P$53 9.525,1.905; P$54 8.255,1.905; P$55 6.985,1.905; P$56 5.715,1.905; P$57 4.445,1.905; P$58 3.175,1.905; P$59 1.905,1.905; P$60 0.635,1.905; P$61 -0.635,1.905; P$62 -1.905,1.905; P$63 -3.175,1.905; P$64 -4.445,1.905; P$65 -5.715,1.905; P$66 -6.985,1.905; P$67 -8.255,1.905; P$68 -9.525,1.905; P$69 -10.795,1.905; P$70 -12.065,1.905; P$71 -13.335,1.905; P$72 -14.605,1.905; P$73 -15.875,1.905; P$74 -17.145,1.905; P$75 -18.415,1.905; P$76 -19.685,1.905; P$77 -20.955,1.905; P$78 -22.225,1.905; P$79 -23.495,1.905; P$80 -24.765,1.905; P$81 24.765,-1.905; P$82 23.495,-1.905; P$83 22.225,-1.905; P$84 20.955,-1.905; P$85 19.685,-1.905; P$86 18.415,-1.905; P$87 17.145,-1.905; P$88 15.875,-1.905; P$89 14.605,-1.905; P$90 13.335,-1.905; P$91 12.065,-1.905; P$92 10.795,-1.905; P$93 9.525,-1.905; P$94 8.255,-1.905; P$95 6.985,-1.905; P$96 5.715,-1.905; P$97 4.445,-1.905; P$98 3.175,-1.905; P$99 1.905,-1.905; P$100 0.635,-1.905; P$101 -0.635,-1.905; P$102 -1.905,-1.905; P$103 -3.175,-1.905; P$104 -4.445,-1.905; P$105 -5.715,-1.905; P$106 -6.985,-1.905; P$107 -8.255,-1.905; P$108 -9.525,-1.905; P$109 -10.795,-1.905; P$110 -12.065,-1.905; P$111 -13.335,-1.905; P$112 -14.605,-1.905; P$113 -15.875,-1.905; P$114 -17.145,-1.905; P$115 -18.415,-1.905; P$116 -19.685,-1.905; P$117 -20.955,-1.905; P$118 -22.225,-1.905; P$119 -23.495,-1.905; P$120 -24.765,-1.905; P$121 24.765,-3.175; P$122 23.495,-3.175; P$123 22.225,-3.175; P$124 20.955,-3.175; P$125 19.685,-3.175; P$126 18.415,-3.175; P$127 17.145,-3.175; P$128 15.875,-3.175; P$129 14.605,-3.175; P$130 13.335,-3.175; P$131 12.065,-3.175; P$132 10.795,-3.175; P$133 9.525,-3.175; P$134 8.255,-3.175; P$135 6.985,-3.175; P$136 5.715,-3.175; P$137 4.445,-3.175; P$138 3.175,-3.175; P$139 1.905,-3.175; P$140 0.635,-3.175; P$141 -0.635,-3.175; P$142 -1.905,-3.175; P$143 -3.175,-3.175; P$144 -4.445,-3.175; P$145 -5.715,-3.175; P$146 -6.985,-3.175; P$147 -8.255,-3.175; P$148 -9.525,-3.175; P$149 -10.795,-3.175; P$150 -12.065,-3.175; P$151 -13.335,-3.175; P$152 -14.605,-3.175; P$153 -15.875,-3.175; P$154 -17.145,-3.175; P$155 -18.415,-3.175; P$156 -19.685,-3.175; P$157 -20.955,-3.175; P$158 -22.225,-3.175; P$159 -23.495,-3.175; P$160 -24.765,-3.175 | hole 1.321: 27.165,0; -27.191,3.048
SOT223 = smd 1.219 x 2.235: 1 -2.311,-3.099; 2 0,-3.099; 3 2.311,-3.099 | smd 3.6 x 2.2: 4 0,3.099
1210 = smd 1.651 x 2.794: 1 -1.397,0; 2 1.397,0
JP3 = drill 0.914 long: 1 0,0; 2 2.54,0; 3 5.08,0
569-011X-X00_LED_ARRAY = drill 1.016 octagon: A1 -6.35,0; A2 -1.27,0; C1 -8.89,0; C2 -3.81,0
SOT23-GSD = smd 0.8 x 0.9: D 0,0; G -0.95,-2.1; S 0.95,-2.1
P1-13 = drill 1.321 pad 2.159 octagon: TP 0,0
TP06R = smd 0.6 x 0.6: TP 0,0
SOP65P490X110-9N = smd 1.422 x 0.432: 1 -2.184,0.965; 2 -2.184,0.33; 3 -2.184,-0.33; 4 -2.184,-0.965; 5 2.184,-0.965; 6 2.184,-0.33; 7 2.184,0.33; 8 2.184,0.965 | smd 1.575 x 1.88: 9 0,0
SOIC127P500X400-8N = smd 1.778 x 0.635: 1 -2.819,1.905; 2 -2.819,0.635; 3 -2.819,-0.635; 4 -2.819,-1.905; 5 2.819,-1.905; 6 2.819,-0.635; 7 2.819,0.635; 8 2.794,1.905
MEV3 = drill 1 octagon: P1 -7.62,0; P2 -5.08,0; P3 2.54,0; P4 7.62,0
PCI-ADDIN_STD-H_HALF-L = hole 3.175: 7.493,4.851; 7.493,90.246
SOT-23-5 = smd 0.55 x 1: 1 -0.95,-1.35; 2 0,-1.35; 3 0.95,-1.35; 4 0.95,1.35; 5 -0.95,1.35
SO14 = smd 0.6 x 2.2: 1 -3.81,-2.6; 2 -2.54,-2.6; 3 -1.27,-2.6; 4 0,-2.6; 5 1.27,-2.6; 6 2.54,-2.6; 7 3.81,-2.6; 8 3.81,2.6; 9 2.54,2.6; 10 1.27,2.6; 11 0,2.6; 12 -1.27,2.6; 13 -2.54,2.6; 14 -3.81,2.6

### Placement (x,y rotation side)
A  83.57,88.57 0 top
B  130.18,88.7 0 top
C1  117.98,69.39 180 top
C2  118.87,71.68 180 top
C3  123.19,67.11 0 top
C4  97.03,65.2 90 top
C5  107.44,67.61 90 top
C6  -44.45,-147.9 0 top  (outside the outline)
C7  116.97,58.22 180 top
C8  97.03,60.88 0 top
C9  107.44,60.63 180 top
C10  99.57,61.65 270 top
C11  116.97,56.44 180 top
C12  117.98,60.5 180 top
C13  122.68,58.85 0 top
C15  99.57,56.31 0 top
C16  105.41,56.31 180 top
C17  105.41,41.33 180 top
C18  99.69,41.33 0 top
C19  123.95,44.75 270 top
C20  84.07,47.93 180 top
C21  82.93,43.87 180 top
C22  82.93,45.64 180 top
C23  84.96,59.11 180 top
C24  84.07,56.82 180 top
C25  129.54,25.2 180 bottom
C26  139.45,18.59 0 top
C27  126.36,25.2 180 bottom
C28  139.45,22.91 0 top
C29  132.72,25.2 180 bottom
C30  129.67,21.01 0 bottom
C31  132.72,21.01 0 bottom
C32  126.49,21.01 0 bottom
C33  -35.56,-38.68 0 top  (outside the outline)
C34  -15.24,-71.7 0 top  (outside the outline)
C35  -31.75,-102.18 0 top  (outside the outline)
C36  -35.56,-105.99 0 top  (outside the outline)
C37  -35.56,-111.07 0 top  (outside the outline)
C_ISO  120.4,88.7 0 top
D1  111.76,78.66 0 bottom
D2  111.76,80.44 180 bottom
D3  103.63,78.66 0 bottom
D4  103.63,80.44 180 bottom
D5  95.5,78.66 0 bottom
D6  95.5,80.44 180 bottom
D7  -34.29,-71.7 0 top  (outside the outline)
D8  -24.13,-71.7 0 top  (outside the outline)
D9  -34.29,-116.15 0 top  (outside the outline)
DI0  113.54,88.57 270 top
DI1  -25.4,-47.57 0 top  (outside the outline)
DI_ISO  95.89,48.82 180 top
DO0  105.41,88.57 270 top
DO1  97.28,88.57 270 top
DO_ISO  109.22,48.82 0 top
F1  -5.08,4.5 0 top
F2  -12.7,4.5 0 top  (outside the outline)
F3  -20.32,4.5 0 top  (outside the outline)
F4  -17.78,-45.03 0 top  (outside the outline)
FMC  107.7,25.32 0 bottom
IC1  -43.18,-112.34 0 top  (outside the outline)
L1  119.63,57.33 90 top
L2  85.72,44.75 90 top
L3  -44.45,-119.96 0 top  (outside the outline)
L4  -44.45,-125.04 0 top  (outside the outline)
L5  -43.18,-131.39 0 top  (outside the outline)
POW_TP  105.16,37.52 180 top
PWR_ISO  125.22,77.9 270 top
Q1  -29.21,-17.09 0 top  (outside the outline)
Q2  -26.67,-56.46 0 top  (outside the outline)
R1  -20.32,-3.12 0 top  (outside the outline)
R2  -20.32,-8.2 0 top  (outside the outline)
R3  -20.32,-13.28 0 top  (outside the outline)
R4  124.08,76.12 0 top
R5  118.87,73.46 180 top
R6  116.2,72.57 270 top
R7  124.08,74.09 0 top
R8  91.19,69.52 180 top
R9  94.23,69.52 180 top
R10  112.9,58.72 180 top
R11  -21.59,-19.63 0 top  (outside the outline)
R12  84.96,60.88 180 top
R13  82.3,59.99 270 top
R14  -29.21,-24.71 0 top  (outside the outline)
R15  -35.56,-29.79 0 top  (outside the outline)
R16  -35.56,-34.87 0 top  (outside the outline)
R17  -19.05,-57.73 0 top  (outside the outline)
R18  -34.29,-65.35 0 top  (outside the outline)
R19  -24.13,-65.35 0 top  (outside the outline)
R20  -35.56,-78.05 0 top  (outside the outline)
R21  -30.48,-78.05 0 top  (outside the outline)
R22  -25.4,-78.05 0 top  (outside the outline)
R23  -21.59,-78.05 0 top  (outside the outline)
R24  -35.56,-93.29 0 top  (outside the outline)
R25  -35.56,-98.37 0 top  (outside the outline)
R26  -44.45,-137.74 0 top  (outside the outline)
R27  -44.45,-142.82 0 top  (outside the outline)
TP1  115.95,75.49 180 top
TP2  113.54,80.06 180 top
TP3  113.54,78.54 180 top
TP4  112.9,77.77 0 top
TP5  112.9,80.82 0 top
TP6  112.9,79.3 0 top
TP7  113.54,77.01 180 top
TP8  -45.72,-151.71 0 top  (outside the outline)
TP9  113.54,83.11 180 top
TP10  122.05,75.74 270 top
TP11  112.9,83.87 0 top
TP12  113.54,81.58 180 top
TP13  100.46,77.9 270 top
TP14  112.9,82.35 0 top
TP15  120.52,62.79 90 top
TP_CS  109.86,37.9 270 top
TP_H1  111.12,37.9 270 top
TP_H2  95.25,38.28 270 top
TP_H3  93.98,38.28 270 top
TP_MISO1  97.79,38.28 270 top
TP_MISO2  96.52,38.28 270 top
TP_MOSI  107.31,37.9 270 top
TP_SCLK  108.58,37.9 270 top
U1  117.98,64.95 270 top
U3  103.12,63.93 90 top
U4  111.76,63.93 90 top
U5  92.71,63.93 270 top
U6  120.78,50.09 90 top
U7  84.07,52.37 270 top
U$1  114.55,49.71 0 bottom
U$2  0,4.5 0 top
U$5  -35.56,-22.17 0 top  (outside the outline)
U$6  -35.56,-57.73 0 top  (outside the outline)
U$7  -30.48,-86.94 0 top  (outside the outline)

### Tracks (layer width: path | path; a pad name or v marks a point on that pad's centre or on a via)
12V_FPGA  (via drill 0.3, 0.9)  (1 unrouted)
  Top 0.305: v126.75,22.78 FMC.P$155 | FMC.P$157 v129.29,22.78
  Top 0.406: 128.65,20.5 arc-90 128.52,20.37
  Top 0.61: 126.11,20.62 126.11,20.37 | C19.1 121.92,46.41
  Top 0.813: FMC.P$155 126.11,20.62 | FMC.P$157 128.65,20.5
  Top 1.016: C28.+ C26.+ 135.38,18.59 135.38,20.37 | 81.79,26.85 82.17,26.47 82.17,24.31 81.79,23.93 81.79,20.37 126.11,20.37 128.52,20.37 135.38,20.37 | v135.38,25.83 135.38,20.37 | v126.24,44.12 126.24,45.39 125.22,46.41 C19.1
  Bottom 0.305: C30.2 128.8,22.3 v129.29,22.78 | C32.2 125.63,21.67 v126.75,22.78
  Bottom 0.813: 133.48,30.15 133.48,27.74 134.49,26.72
  Bottom 1.016: v126.24,44.12 126.24,34.34 128.52,32.05 131.57,32.05 133.48,30.15 | v135.38,25.83 134.49,26.72
$N1  (7 unrouted)
$N3  (6 unrouted)
  Bottom 0.254: 113.56,82.1 D2.C D1.A
$N101  (3 unrouted)
  Bottom 0.254: D3.A D4.C 105.41,80.46
$N102  (3 unrouted)
  Bottom 0.254: 97.3,82.1 D6.C D5.A
+3V3  (via drill 0.3, 0.48)
  Top 0.254: v92.71,42.21 DI_ISO.P10 | FMC.P$118 v130.56,24.05 | FMC.P$120 v131.83,22.78 FMC.P$159 | FMC.P$116 v128.02,24.05
  Top 0.406: DO_ISO.P1 104.78,41.55 C17.2 v103.38,41.33 | DI_ISO.P16 100.33,41.68 C18.2 v101.73,41.33
  $VCC 0.254: 117.86,41.83 117.6,42.09
  Bottom 0.254: v130.56,24.05 130.53,24.08 130.53,25.07 C25.2 | v133.1,24.05 133.58,24.54 C29.2 | C31.2 131.85,22.76 v131.83,22.78 | v128.02,24.05 127.23,24.84 C27.2
  pour $VCC (rank 2): 153.67,12.12 153.67,79.17 135.41,79.17 arc-90 132.59,81.99 132.59,108.64 127.13,108.64 127.13,47.55 118.49,47.55 118.49,44.75 88.14,44.75 88.14,108.64 81.28,108.64 81.28,81.27 arc-90 79.3,79.3 64.77,79.3 64.77,12.12
+3V3_ISO  (via drill 0.3, 0.48)  (22 unrouted)
  Top 0.254: DO_ISO.P10 112.52,54.03 112.52,55.3 v112.65,55.42 | TP13.TP 100.46,78.54 v100.58,78.66
  Top 0.305: R7.1 123.22,72.97 v123.06,72.82
  Top 0.406: C16.2 104.65,56.59 | 97.16,63.42 C4.+ v97.03,64.95 | 96.27,60.88 C8.1 | v104.65,57.58 C16.2 | DO_ISO.P16 104.78,56.08 C16.2 | DI_ISO.P1 100.33,56.21 C15.2 v100.33,57.58 | U4.1 108.79,61.11 C9.1 108.31,61.67 v108.33,61.77 | U5.8 95.91,61.14 C8.1 | C8.1 96.16,59.64 v96.14,59.61 | v107.44,64.69 C5.+ | v99.57,63.68 C10.1 99.82,62.51 U3.1 | 122.25,63.5 122.68,63.93 122.68,66.98 | 121.67,67.23 C3.1
  Top 0.61: 122.68,66.98 122.43,67.23 121.67,67.23
  other vias: 123.06,68.88 122.17,68.88 121.28,68.88
  pour $VCC (isolate 0.254): 89.79,94.67 89.79,52.63 118.49,52.63 118.49,50.09 125.48,50.09 125.48,94.67
  pour Top (no thermals): 123.44,69.27 123.44,65.84 121.03,65.84 121.03,69.27
+3V6  (via drill 0.3, 0.48)
  Top 0.254: B.B6 128.02,87.68 127.51,87.17 | A.B6 81.66,87.55 81.28,87.17 81.28,81.46 81.41,81.33
  Top 0.406: C24.1 85.04,56.13 U7.1 85.06,54.53 85.6,54.53
  Top 0.61: C24.1 85.72,59 C23.1 R12.1 v86.74,60.88 | 81.41,81.33 81.41,74.22 79.88,72.69 v79.88,60.88 79.88,26.97 79.25,26.34 79.25,24.43 79.88,23.8 79.88,18.72 v131.83,18.72 | 127.51,87.17 127.51,70.79 v131.44,66.85 | v86.87,54.53 85.6,54.53
  Bottom 0.61: v86.74,60.88 v79.88,60.88 | v131.44,66.85 136.65,66.85 138.94,64.57 138.94,32.56 136.78,30.4 136.78,18.72 v131.83,18.72 | 102.62,38.28 97.28,43.61 88.71,43.61 87.63,44.69 87.63,53.77 v86.87,54.53
+3V6_ISO
  Top 0.254: TP10.TP 121.92,75.64 122.61,76.33
  Top 0.305: R4.1 123.14,76.2 122.73,76.45
  Top 0.406: U1.1 118.95,67.18 119.38,67.61 | 118.11,88.44 118.81,87.74 C_ISO.B6
  Top 0.61: 119.38,67.61 119.63,67.87 C1.1 119.63,69.9 119.74,70 C2.1 R5.1 122.61,76.33 122.73,76.45 122.81,76.53 122.81,90.98 122.17,91.62 118.75,91.62 118.11,90.98 118.11,88.44
+5V0  (via drill 0.3)
  Top 0.254: 118.97,62.79 v119.63,62.79 TP15.TP | v116.2,62.79 116.23,62.76
  Bottom 0.254: v119.63,62.79 v116.2,62.79
+9V0_ISO  (5 unrouted)
  Top 0.61: 122.05,52.63 U6.P4 120.78,55.32
A_CS+  (via drill 0.3)
  Top 0.254: v85.85,87.55 A.B1 | v108.33,26.34 FMC.P$61
  Bottom 0.254: v85.85,87.55 85.22,86.92 85.22,74.98 82.3,71.3 82.3,65.46 78.49,61.65 78.49,38.53 79.76,37.26 96.9,37.26 99.19,34.98 104.65,34.98 108.71,30.91 108.71,26.72 v108.33,26.34
A_CS-  (via drill 0.3)
  Top 0.254: v85.98,85.39 85.98,85.59 A.T1 | v109.6,26.34 FMC.P$62
  Bottom 0.254: v85.98,85.39 85.98,74.73 82.8,70.79 82.8,65.2 78.99,61.39 78.99,39.04 80.26,37.77 97.12,37.77 99.41,35.48 104.9,35.48 109.35,31.04 109.35,26.59 v109.6,26.34
A_MISO1+  (via drill 0.3)
  Top 0.254: A.B4 83.19,87.62 v83.19,88.82 | v96.9,26.34 FMC.P$52
  Bottom 0.254: v83.19,88.82 83.19,80.57 79.25,75.87 79.25,66.98 75.44,63.17 75.44,35.48 76.71,34.21 93.24,34.21 97.16,30.3 97.16,26.59 v96.9,26.34
A_MISO1-  (via drill 0.3)
  Top 0.254: A.T4 83.19,86.35 83.19,79.3 v82.93,79.04 | v98.17,26.34 FMC.P$53
  Bottom 0.254: v82.93,79.04 79.76,75.11 79.76,66.73 75.95,62.92 75.95,35.99 77.22,34.72 93.47,34.72 97.79,30.4 97.79,26.72 v98.17,26.34
A_MISO2+  (via drill 0.3)
  Top 0.254: A.B5 82.55,87.62 v82.55,89.97 | v93.09,26.21 FMC.P$49
  Bottom 0.254: v82.55,89.97 82.55,82.22 78.23,77.14 78.23,67.49 74.42,63.68 74.42,34.47 75.69,33.2 90.81,33.2 93.34,30.66 93.34,26.47 v93.09,26.21
A_MISO2-  (via drill 0.3)
  Top 0.254: v82.42,81.08 82.61,81.27 A.T5 | v94.36,26.21 FMC.P$50
  Bottom 0.254: v82.42,81.08 78.74,76.63 78.74,67.23 74.93,63.42 74.93,34.98 76.2,33.71 91.06,33.71 93.98,30.78 93.98,26.59 v94.36,26.21
A_MOSI+  (via drill 0.3)
  Top 0.254: v83.95,89.97 83.88,89.9 A.B3 | v100.71,26.34 FMC.P$55
  Bottom 0.254: v83.95,89.97 83.95,78.79 80.26,74.35 80.26,66.47 76.45,62.66 76.45,36.5 77.72,35.23 94.36,35.23 101.09,28.5 101.09,26.72 v100.71,26.34
A_MOSI-  (via drill 0.3)
  Top 0.254: 83.95,86.35 A.T3 | 83.82,86.41 A.T3 | A.T3 83.88,77.46 v83.69,77.27 | v101.98,26.34 FMC.P$56
  Bottom 0.254: v83.69,77.27 80.77,73.58 80.77,66.22 76.96,62.41 76.96,37.01 78.23,35.74 94.61,35.74 101.73,28.63 101.73,26.59 v101.98,26.34
A_SCLK+  (via drill 0.3)
  Top 0.254: v84.71,88.82 84.52,88.63 A.B2 | v104.52,26.34 FMC.P$58
  Bottom 0.254: v84.71,88.82 84.45,88.57 84.45,76.76 81.28,72.82 81.28,65.96 77.47,62.15 77.47,37.52 78.74,36.25 95.12,36.25 97.92,33.45 102.36,33.45 104.9,30.91 104.9,26.72 v104.52,26.34
A_SCLK-  (via drill 0.3)
  Top 0.254: A.T2 84.52,75.55 v84.45,75.49 | v105.79,26.34 FMC.P$59
  Bottom 0.254: v84.45,75.49 81.79,72.06 81.79,65.71 77.98,61.9 77.98,38.02 79.25,36.75 95.38,36.75 98.17,33.96 102.62,33.96 105.54,31.04 105.54,26.59 v105.79,26.34
AGND1
  Top 0.406: U7.2 84.4,58.8 C23.2 R12.2 82.32,60.88 R13.1
AGND2
  Top 0.406: U1.2 118.31,69.95 117.98,70.28 117.98,71.65 C2.2 R5.2 116.23,73.46 R6.1
B_CS+  (via drill 0.3)
  Top 0.254: FMC.P$37 128.65,28.75 130.94,31.04 139.19,31.04 140.46,32.31 140.46,68.25 v133.1,75.62 | v132.46,87.68 B.B1
  Bottom 0.254: v133.1,75.62 132.46,76.25 v132.46,87.68
B_CS-
  Top 0.254: FMC.P$38 129.92,28.6 131.85,30.53 139.7,30.53 140.97,31.8 140.97,69.01 131.76,78.22 B.T1
B_MISO1+  (via drill 0.3)
  Top 0.254: v130.05,72.57 137.41,65.2 137.41,35.36 136.14,34.09 122.81,34.09 FMC.P$28 | v129.79,89.2 129.86,89.14 B.B4
  Bottom 0.254: v130.05,72.57 129.79,72.82 v129.79,89.2
B_MISO1-
  Top 0.254: FMC.P$29 123.57,33.58 136.65,33.58 137.92,34.85 137.92,65.71 129.79,73.84 129.79,86.54 B.T4
B_MISO2+  (via drill 0.3)
  Top 0.254: v129.03,71.55 136.4,64.19 136.4,36.37 135.13,35.1 120.02,35.1 FMC.P$25 | v129.03,90.47 129.03,88.44 129.16,88.32 129.16,87.74 B.B5
  Bottom 0.254: v129.03,90.47 v129.03,71.55
B_MISO2-
  Top 0.254: FMC.P$26 120.78,34.59 135.64,34.59 136.91,35.86 136.91,64.69 129.16,72.44 129.16,86.54 B.T5
B_MOSI+  (via drill 0.3)
  Top 0.254: FMC.P$31 121.03,28.68 125.42,33.07 137.16,33.07 138.43,34.34 138.43,66.22 v131.19,73.46 | v130.56,90.47 130.56,87.68 B.B3
  Bottom 0.254: v130.56,90.47 130.56,74.09 v131.19,73.46
B_MOSI-
  Top 0.254: FMC.P$32 122.3,28.75 126.11,32.56 137.67,32.56 138.94,33.83 138.94,66.78 130.49,75.22 B.T3
B_SCLK+  (via drill 0.3)
  Top 0.254: FMC.P$34 128.41,32.05 138.18,32.05 139.45,33.32 139.45,67.23 v132.08,74.6 | B.B2 131.13,89.08 v131.25,89.2
  Bottom 0.254: v132.08,74.6 131.25,75.43 v131.25,89.2
B_SCLK-
  Top 0.254: FMC.P$35 126.11,28.55 129.11,31.55 138.68,31.55 139.95,32.82 139.95,67.74 131.13,76.57 B.T2
CS
  Top 0.254: 109.86,28.75 FMC.P$22
  Top 0.381: 109.86,28.75 TP_CS.TP DO_ISO.P5
CS+_ISOLATED  (via drill 0.3)
  Top 0.254: C_ISO.B1 121.98,89.01 v122.05,89.08 | U4.7 111.12,67.36 110.74,67.74 110.74,76.63 111.12,77.01 TP7.TP 119.38,77.01 v121.54,79.17
  Bottom 0.254: v122.05,89.08 122.05,79.68 v121.54,79.17
CS-_ISOLATED
  Top 0.254: C_ISO.T1 121.98,80.57 119.19,77.77 TP4.TP 110.87,77.77 110.24,77.14 110.24,67.74 109.86,67.36 U4.8
CS_ISO
  Top 0.381: U4.2 111.12,59.99 109.86,58.72 DO_ISO.P12
DI0_TERM_ISO  (1 unrouted)
DI1_TERM_ISO  (1 unrouted)
G24  (via drill 0.3)
  Top 0.254: v127.76,55.3 128.27,55.3 128.52,55.4 | v112.52,35.48 112.6,35.56 112.6,37.16 | 116,39.98 115.82,39.8 v115.82,38.79 | v112.14,26.34 FMC.P$64
  Bottom 0.254: v127.76,55.3 127.51,55.04 127.51,47.68 118.62,38.79 v115.82,38.79 v112.52,35.48 112.14,35.1 v112.14,26.34
G25  (via drill 0.3)
  Top 0.254: v116.84,35.74 117.83,36.73 | v113.41,26.34 FMC.P$65
  Bottom 0.254: v116.84,35.74 113.41,32.31 v113.41,26.34
G27  (via drill 0.3)
  Top 0.254: v118.36,35.74 121.92,35.74 123.17,36.99 | FMC.P$67 v115.95,26.34
  Bottom 0.254: v118.36,35.74 115.95,33.32 v115.95,26.34
GND  (via drill 0.3, 0.48, 0.8)
  Top 0.254: FMC.P$36 v128.02,27.86 | FMC.P$39 v130.56,27.86 | FMC.P$33 v124.21,27.86 | FMC.P$24 v112.78,27.86 | FMC.P$27 v115.32,27.86 | FMC.P$30 v120.4,27.86 | v124.21,22.78 FMC.P$153 | FMC.P$152 v122.94,22.78 | v107.7,22.78 FMC.P$140 | v108.97,22.78 FMC.P$141 | v111.51,27.86 FMC.P$63 | v114.05,27.86 FMC.P$66 | v119.13,27.86 FMC.P$69 | v121.67,27.86 FMC.P$72 | v125.48,27.86 FMC.P$75 | v129.29,27.86 FMC.P$78 | v131.83,27.86 FMC.P$80 | v103.89,22.78 FMC.P$137 | FMC.P$136 v102.62,22.78 | v98.81,22.78 FMC.P$133 | v96.27,22.78 FMC.P$132 | FMC.P$129 v92.46,22.78 | FMC.P$128 v91.19,22.78 | FMC.P$44 v86.11,27.86 | v83.57,22.78 FMC.P$121 | FMC.P$124 v86.11,22.78 FMC.P$83 | v87.38,22.78 FMC.P$125 | v117.86,22.78 FMC.P$148 | FMC.P$149 v119.13,22.78 | v111.51,22.78 FMC.P$144 | v114.05,22.78 FMC.P$145 | v95,27.86 FMC.P$51 | v98.81,27.86 FMC.P$54 | v102.62,27.86 FMC.P$57 | v91.19,27.86 FMC.P$48 | v83.57,27.86 FMC.P$41 | FMC.P$3 v84.84,27.86 | FMC.P$60 v107.7,27.86 FMC.P$21 | v110.11,22.78 FMC.P$102 | v112.78,22.78 FMC.P$105 | v116.59,22.78 FMC.P$108 | FMC.P$93 v97.54,22.78 | FMC.P$90 v93.73,22.78 | FMC.P$87 v89.92,22.78 | FMC.P$99 v105.16,22.78 | FMC.P$86 v88.65,22.78 | FMC.P$82 v84.84,22.78 | FMC.P$96 v101.35,22.78 | v103.89,27.86 FMC.P$18 | FMC.P$9 v92.46,27.86 | FMC.P$6 v88.65,27.86 | FMC.P$45 v87.38,27.86 | FMC.P$12 v96.27,27.86 | FMC.P$15 v100.08,27.86 | FMC.P$119 v131.83,24.05 | FMC.P$117 v129.29,24.05 | B.T6 128.59,85.46 v128.4,85.27
  Top 0.305: A.T6 81.92,86.35 v81.92,85.14
  Top 0.406: FMC.P$156 v128.02,22.78 | v133.1,22.78 FMC.P$160 | v130.56,22.78 FMC.P$158 | DO_ISO.P2 106.05,41.55 C17.1 106.3,41.3 v106.3,40.06 | DI_ISO.P15 99.06,41.43 C18.1 98.93,41.3 v98.93,40.06 | DO_ISO.P8 v114.43,43.74 | DI_ISO.P9 v91.44,41.96
  Top 0.61: C19.2 122.05,45.01 U6.P2
  Top 1.016: C28.- v140.84,20.75 C26.-
  $GND 0.254: 121.16,38.53 121.41,36.75 | 116.08,36.25 116.08,36.75
  Bottom 0.254: v131.83,24.05 131.85,24.08 C29.1 | v129.29,24.05 129.29,24.71 C25.1 | C31.1 133.58,22.3 v133.1,22.78 | C30.1 130.53,22.76 v130.56,22.78 | v125.48,24.18 125.5,24.18 C27.1
  Bottom 0.305: C32.1 127.36,22.12 v128.02,22.78
  other vias: 83.44,52.37 84.71,52.37 81.15,42.72 82.8,42.72 81.15,44.75 81.15,46.91 81.15,49.2 81.15,51.36 86.11,51.23 86.11,53.39 81.15,53.64 81.15,55.55 81.15,57.71
  pour $GND (rank 2): 153.67,12.12 64.77,12.12 64.77,79.3 79.23,79.3 arc90 81.28,81.35 81.28,108.64 88.14,108.64 88.14,44.75 118.49,44.75 118.49,47.55 127.13,47.55 127.13,108.64 132.59,108.64 132.59,82.03 arc90 135.44,79.17 153.67,79.17
  pour Top (no thermals): 80.9,42.34 84.2,42.34 84.2,50.98 86.49,50.98 86.49,53.77 83.31,53.77 83.31,59.99 80.9,59.99
GND_ISO  (via drill 0.3, 0.48)  (84 unrouted)
  Top 0.254: R10.1 113.77,57.73 v113.79,57.71
  Top 0.305: C_ISO.T6 v118.11,86.54
  Top 0.406: v99.57,59.61 C10.2 | v97.03,68.25 C4.- | DO_ISO.P15 106.05,56.08 C16.1 106.3,56.34 v106.3,57.58 | DI_ISO.P2 99.06,55.96 C15.1 98.55,56.46 v98.55,57.58 | DO_ISO.P9 v113.67,55.68 | v91.44,55.68 DI_ISO.P8 | U5.5 v90.81,62.79 | U3.4 v105.03,62.79 | C9.2 106.58,60.53 v106.55,61.77 | C8.2 97.89,59.64 v97.92,59.61 | v107.44,68 C5.- | U4.4 v113.67,62.79
  Top 0.61: C3.2 v124.84,65.33 | v124.84,58.85 C13.2 122.68,59.89 | 121.92,51.23 U6.P3
  Bottom 0.254: D6.A v92.46,80.44 | D4.A v100.58,80.44 | v108.71,76.38 108.71,79.19 D2.A
  other vias: 117.35,64.95 118.62,64.95 115.06,55.3 116.71,55.3 115.06,57.33 115.06,59.49 115.06,61.77 115.06,63.93 120.02,63.8 120.02,65.96 115.06,66.22 115.06,68.12 115.06,70.28 115.06,72.19
  pour $GND (isolate 0.254): 89.79,94.67 89.79,52.63 118.49,52.63 118.49,50.09 125.48,50.09 125.48,94.67
  pour Top (no thermals): 114.81,54.91 118.11,54.91 118.11,63.55 120.4,63.55 120.4,66.34 117.22,66.34 117.22,72.57 114.81,72.57
H13
  Top 0.381: FMC.P$13 93.98,32.69 TP_H3.TP DI_ISO.P11
H13_ISO  (via drill 0.3)  (2 unrouted)
  Top 0.254: DI_ISO.P6 v93.98,55.42
  Bottom 0.254: 97.3,77.54 93.98,74.22 v93.98,55.42
H14
  Top 0.381: FMC.P$14 95.25,32.69 TP_H2.TP DI_ISO.P12
H14_ISO  (via drill 0.3)  (2 unrouted)
  Top 0.254: DI_ISO.P5 v95.25,55.42
  Bottom 0.254: v95.25,55.42 95.25,74.47 97.16,76.38 103.63,76.38 105.43,78.18
H23
  Top 0.254: 111.12,28.75 FMC.P$23
  Top 0.381: 111.12,28.75 TP_H1.TP DO_ISO.P6
H23_ISO  (via drill 0.3)  (1 unrouted)
  Top 0.254: v111.12,55.42 DO_ISO.P11
  Bottom 0.254: v111.12,55.42 111.12,63.8 113.54,66.22 113.54,78.66
MISO1
  Top 0.381: DI_ISO.P14 TP_MISO1.TP 97.79,33.96 FMC.P$17
MISO1+_ISOLATED  (via drill 0.3)
  Top 0.254: C_ISO.B4 120.08,90.54 v120.02,90.6 | 93.37,66.78 U5.2 93.34,65.58 93.73,65.2 94.87,65.2 95.38,65.71 95.38,68.63 95.1,68.91 R9.1 94.49,70.13 94.49,70.79 95.25,71.55 98.3,71.55 108.33,81.58 TP12.TP 118.24,81.58 v119.51,82.85
  Bottom 0.254: v120.02,90.6 120.02,83.36 v119.51,82.85
MISO1-_ISOLATED
  Top 0.254: C_ISO.T4 120.08,84.38 118.05,82.35 TP14.TP 108.08,82.35 97.79,72.06 94.74,72.06 93.98,71.3 93.98,70.13 R9.2 93.37,68.99 94.61,67.74 U5.1
MISO1_ISO
  Top 0.381: U5.7 93.34,59.74 97.79,55.3 DI_ISO.P3
MISO2
  Top 0.381: DI_ISO.P13 TP_MISO2.TP 96.52,33.96 FMC.P$16
MISO2+_ISOLATED  (via drill 0.3)
  Top 0.254: C_ISO.B5 119.44,89.01 v119.38,89.08 | 92.05,69.8 R8.1 | R8.1 92.08,69.49 U5.3 | R8.1 91.44,70.13 91.44,70.79 93.47,72.82 97.28,72.82 107.57,83.11 TP9.TP 117.73,83.11 v118.87,84.25
  Bottom 0.254: v119.38,89.08 119.38,84.76 v118.87,84.25
MISO2-_ISOLATED
  Top 0.254: C_ISO.T5 119.44,85.78 117.54,83.87 TP11.TP 107.44,83.87 96.9,73.33 92.96,73.33 90.93,71.3 90.93,70.13 R8.2 | 90.32,69.8 R8.2 | R8.2 90.81,69.04 U5.4
MISO2_ISO
  Top 0.381: U5.6 92.08,59.87 96.52,55.42 DI_ISO.P4
MOSI
  Top 0.381: FMC.P$19 107.31,30.02 TP_MOSI.TP DO_ISO.P3
MOSI_ISO
  Top 0.381: DO_ISO.P14 107.31,57.96 106.81,58.47 104.01,58.47 102.49,59.99 U3.2
N$1
  Top 0.406: C22.1 83.74,45.69 U7.6
N$2  (3 unrouted)
N$3  (1 unrouted)
N$4
  Top 0.406: U1.6 117.65,58.22 C7.1
N$5
  Top 0.254: U4.3 112.39,59.08 R10.2
N$6  (1 unrouted)
N$7  (3 unrouted)
N$8
  Top 0.305: R4.2 124.94,78.89 PWR_ISO.A2
N$9  (3 unrouted)
  Top 0.406: C12.1 118.95,61.19 U1.8
N$10
  Top 0.305: PWR_ISO.A1 124.46,84.25 123.83,83.62 123.83,77.27 124.08,77.01 124.08,74.96 R7.2
N$11  (1 unrouted)
N$12  (via drill 0.3)
  Top 0.254: C_ISO.B3 120.71,89.01 v120.78,89.08 | U3.7 102.49,67.23 102.11,67.61 102.11,73.08 109.09,80.06 TP2.TP 118.62,80.06 v120.27,81.71
  Bottom 0.254: v120.78,89.08 120.78,82.22 v120.27,81.71
N$13
  Top 0.254: U3.8 101.22,67.23 101.6,67.61 101.6,73.58 108.84,80.82 TP5.TP 118.43,80.82 120.71,83.11 C_ISO.T3
N$14  (1 unrouted)
N$15  (via drill 0.3)
  Top 0.254: U3.6 103.76,65.71 104.39,65.07 105.16,65.07 105.79,65.71 105.79,74.35 109.98,78.54 TP3.TP 119,78.54 v120.9,80.44 | C_ISO.B2 121.41,87.68 v121.41,90.6
  Bottom 0.254: v121.41,90.6 121.41,80.95 v120.9,80.44
N$16
  Top 0.254: U3.5 105.05,66.75 105.28,66.98 105.28,74.85 109.73,79.3 TP6.TP 118.87,79.3 121.41,81.84 121.41,86.47 C_ISO.T2
N$17  (1 unrouted)
N$18  (2 unrouted)
N$19  (1 unrouted)
N$20  (2 unrouted)
N$21  (2 unrouted)
  Top 0.406: C13.1 121.64,60.71
  Top 0.61: 120.98,58.19 C13.1
N$22  (1 unrouted)
N$23  (1 unrouted)
N$24  (2 unrouted)
N$25  (2 unrouted)
SCLK
  Top 0.381: FMC.P$20 108.58,30.02 TP_SCLK.TP DO_ISO.P4
SCLK_ISO
  Top 0.381: U3.3 103.76,60.08 104.48,59.36 107.06,59.36 108.58,57.96 DO_ISO.P13
TDI-TDO
  Top 0.254: FMC.P$111 FMC.P$110
V_PROTECT  (via drill 0.3)  (8 unrouted)
  Bottom 0.254: v109.6,77.01 109.6,78.3 D1.C | D5.C v92.46,78.66
VDD_POST_LC  (via drill 0.3)
  Top 0.254: U7.8 85.06,50.22 v85.72,50.22 | v82.3,50.22 82.32,50.19 U7.5
  Top 0.406: C21.1 85.55,45.62 L2.2 | C20.1 85.04,48.62 U7.8
  Top 0.61: L2.2 C20.1
  Bottom 0.254: v85.72,50.22 v82.3,50.22

### Text on the board
tPlace: to FMC H14 | to FMC H13 | from FMC H23 | A | C | B | isolated | isolated | - | + | direct FMC 3.3V ONLY | FMC_12P0V | COMMON | VDD_AUX | GND | +3v6 | +3v3
bPlace: A | C | B | isolated | to FMC H13 | to FMC H14 | from FMC H23 | G21 | G24 | direct FMC 3.3V ONLY | FMC IO Module / Rev. 0.1 / 2016.03 | G22